# EasyEDA Pro project STM32平衡小车V1.0.eprj

# Schematic 平衡小车

## Sheets
1 STM32F103C8T6: Create Date: 2023-11-09; Page Name: STM32F103C8T6; Project Name: STM32平衡小车V1.1; Schematic Name: 平衡小车V1.0; Update Date: 2023-12-01; Company: 嘉立创EDA; Page Size: A4; Version: V1.0
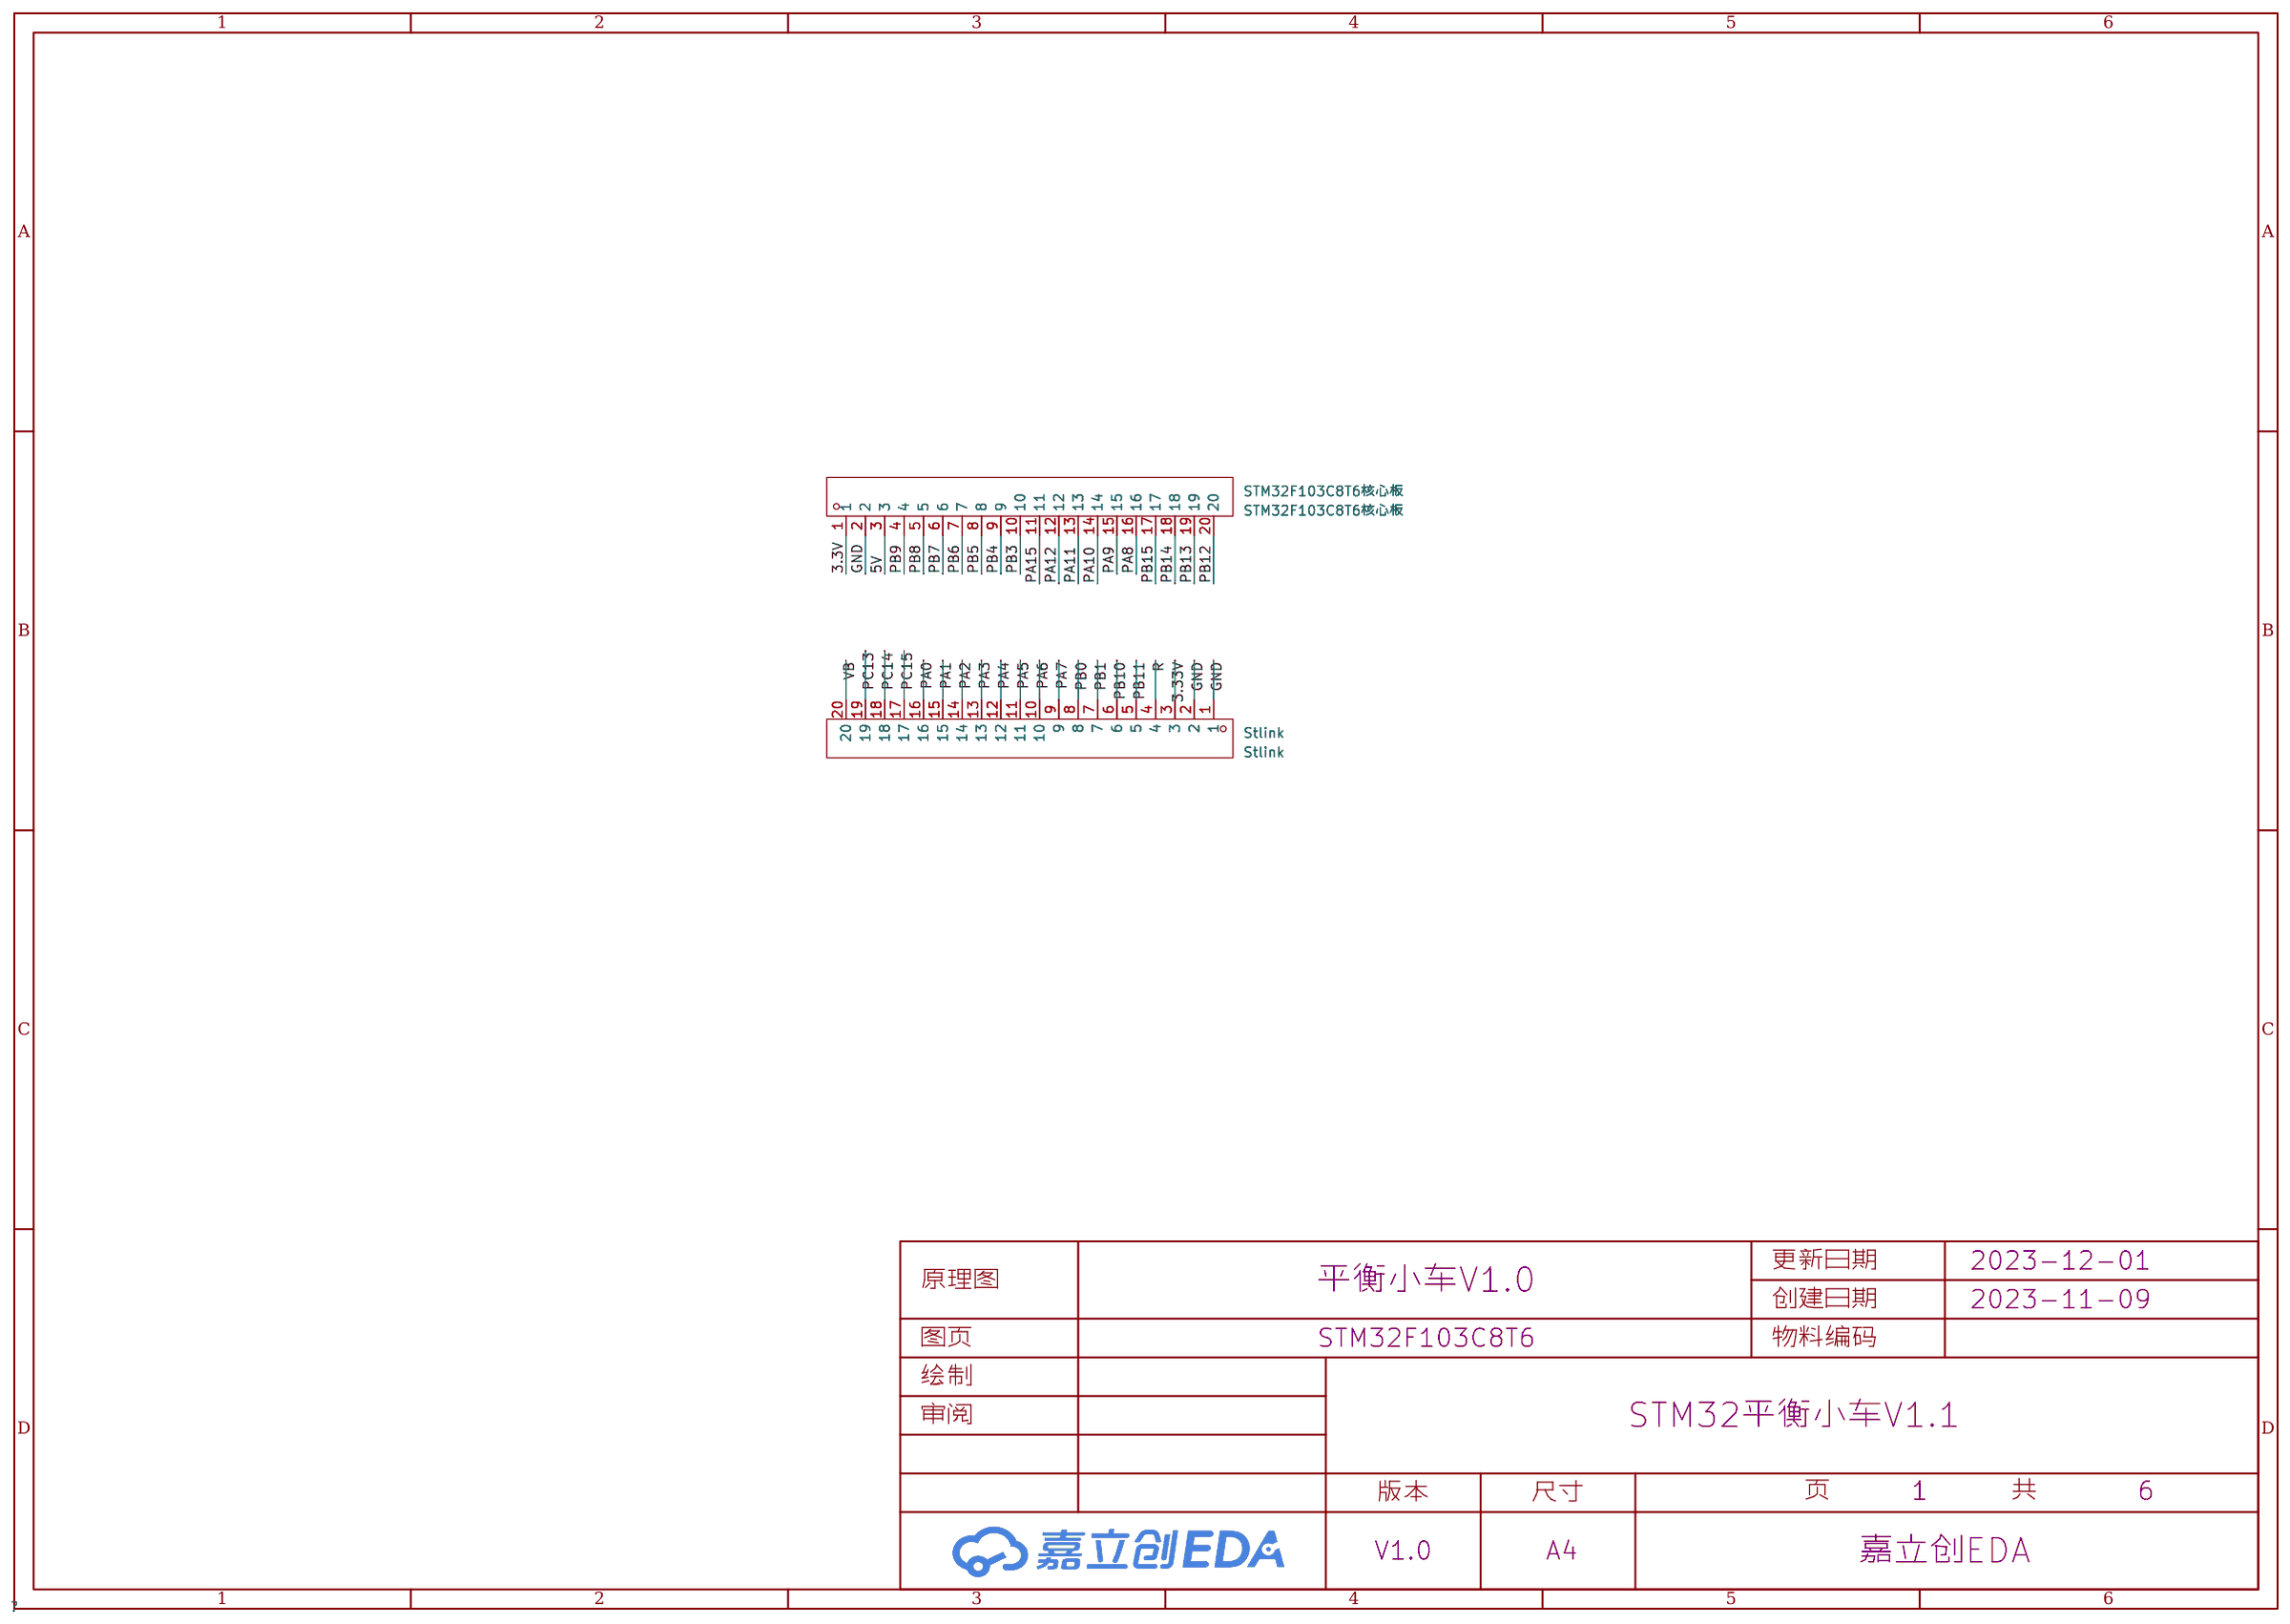
[diagram p0: STM32F103C8T6]
2 串口: Page Name: 串口
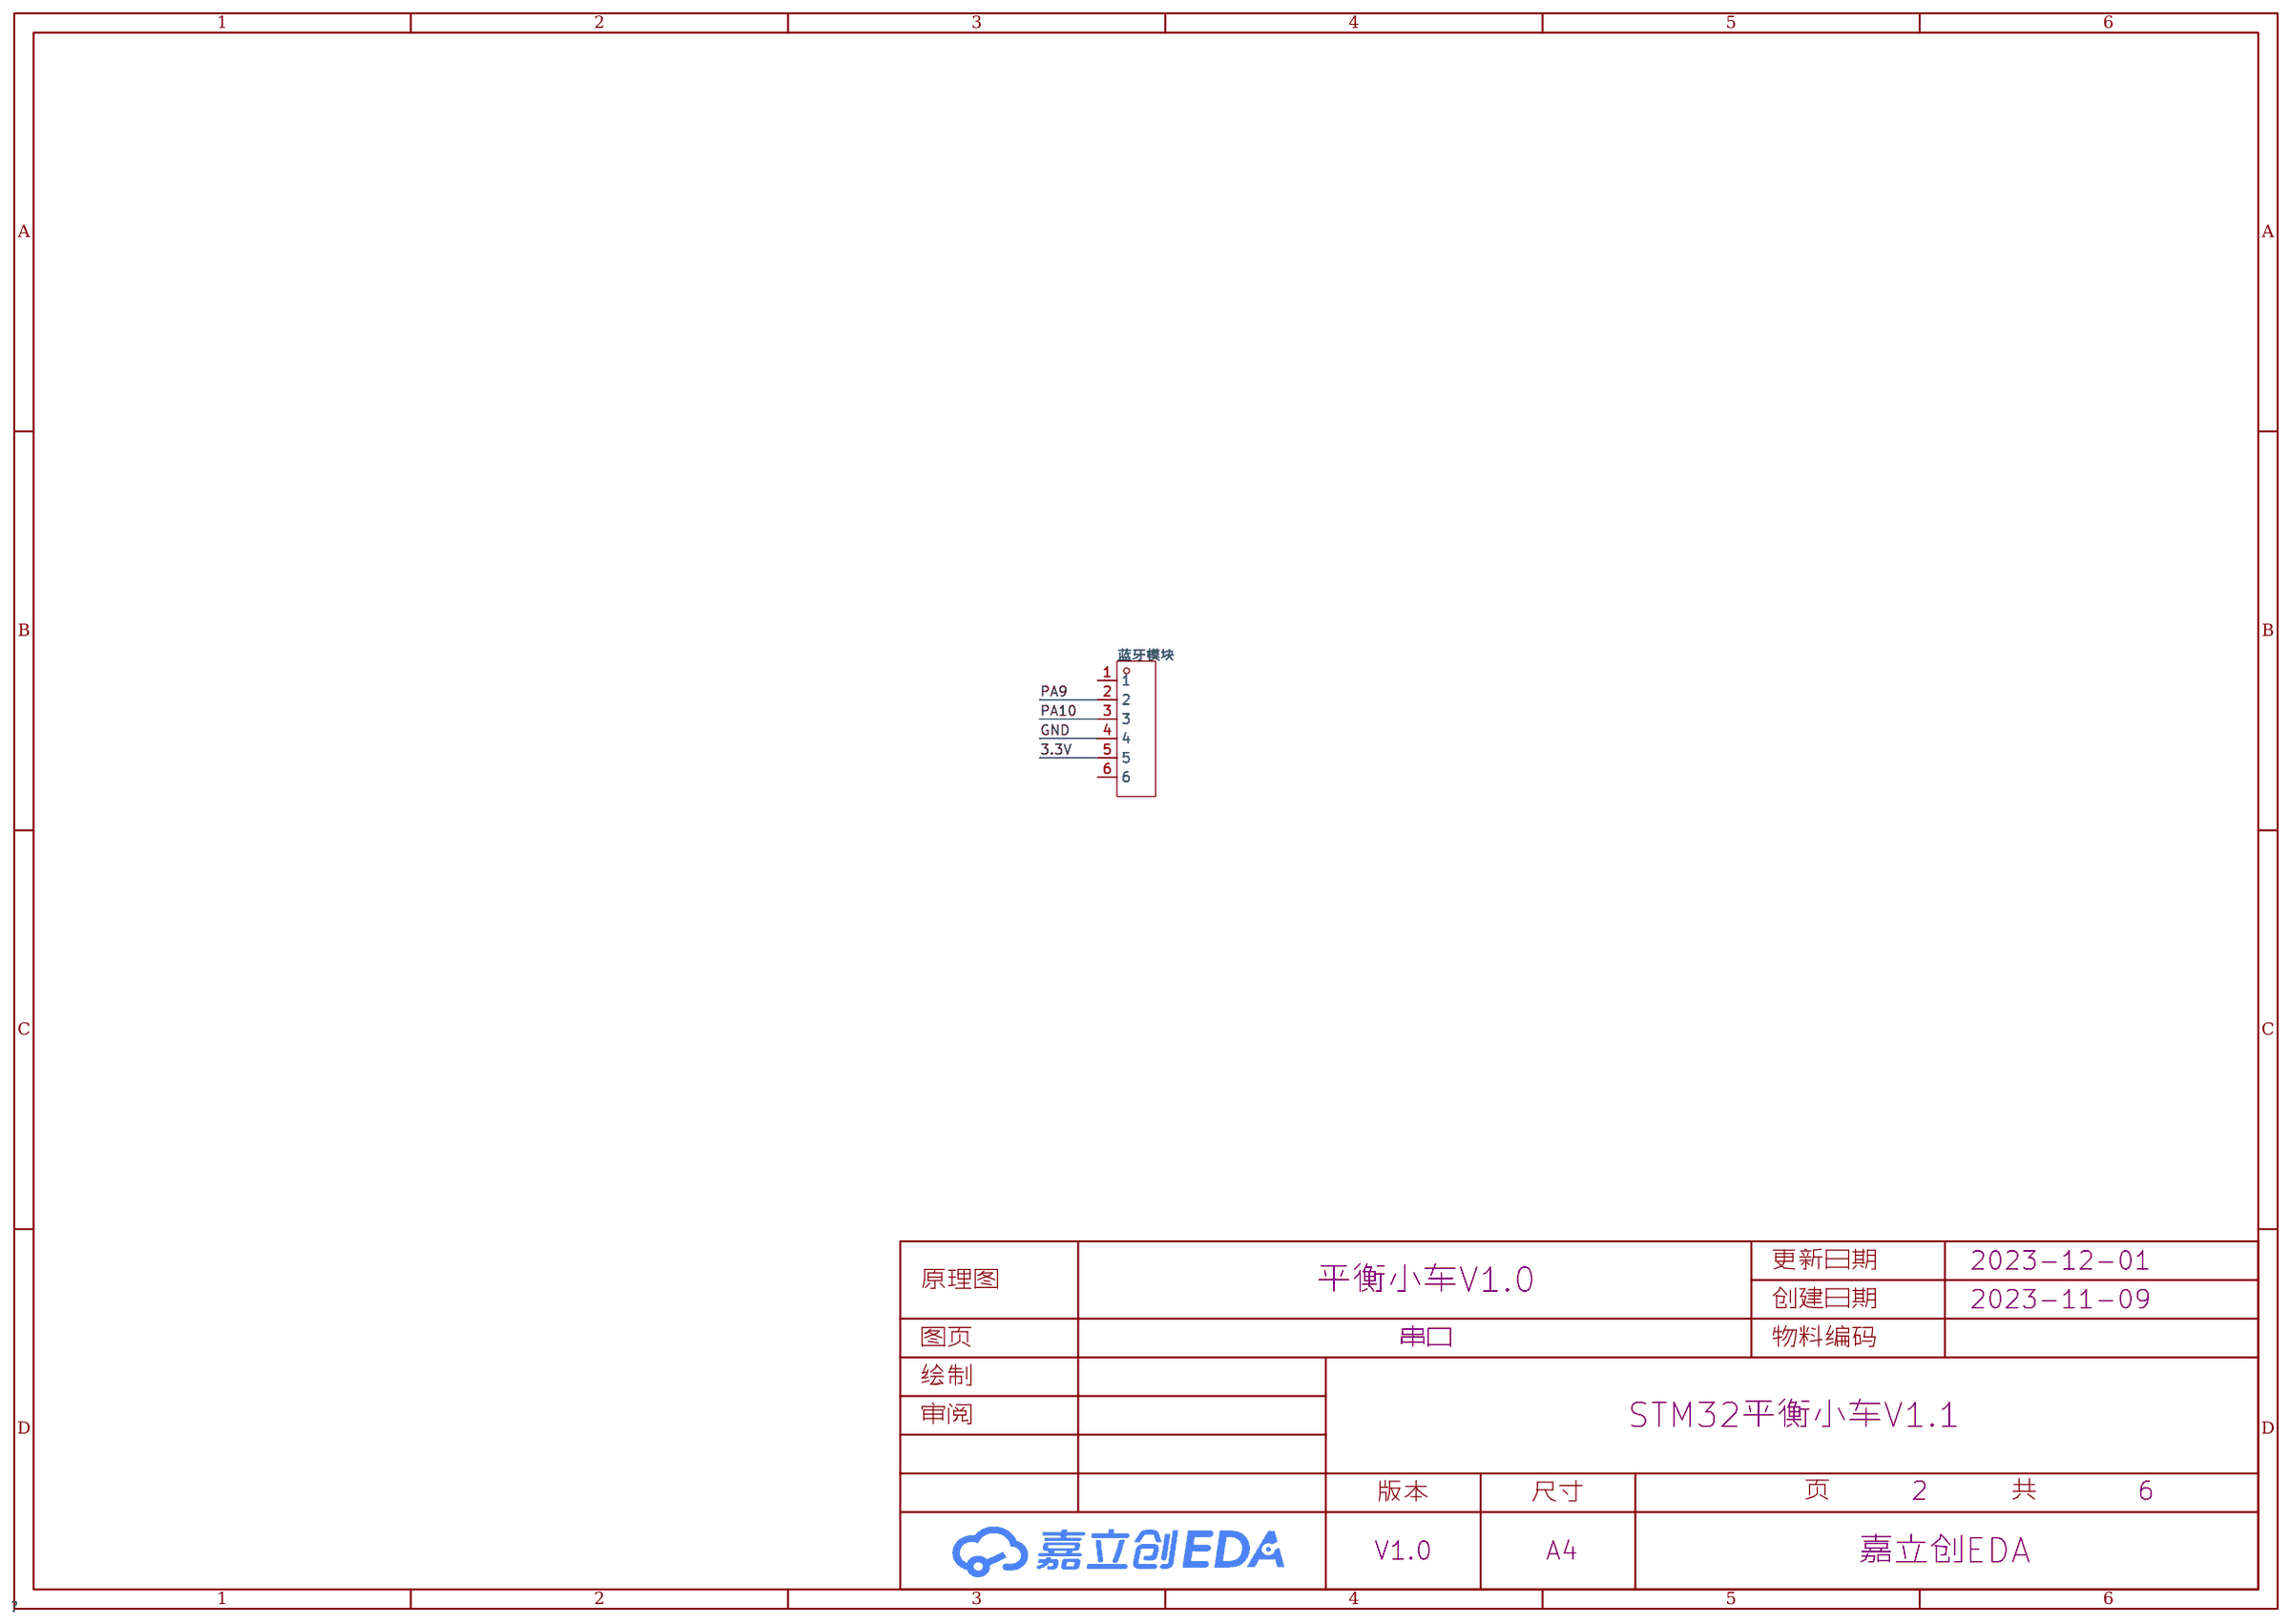
[diagram p1: 串口]
3 陀螺仪: Page Name: 陀螺仪; Update Date: 2023-11-09
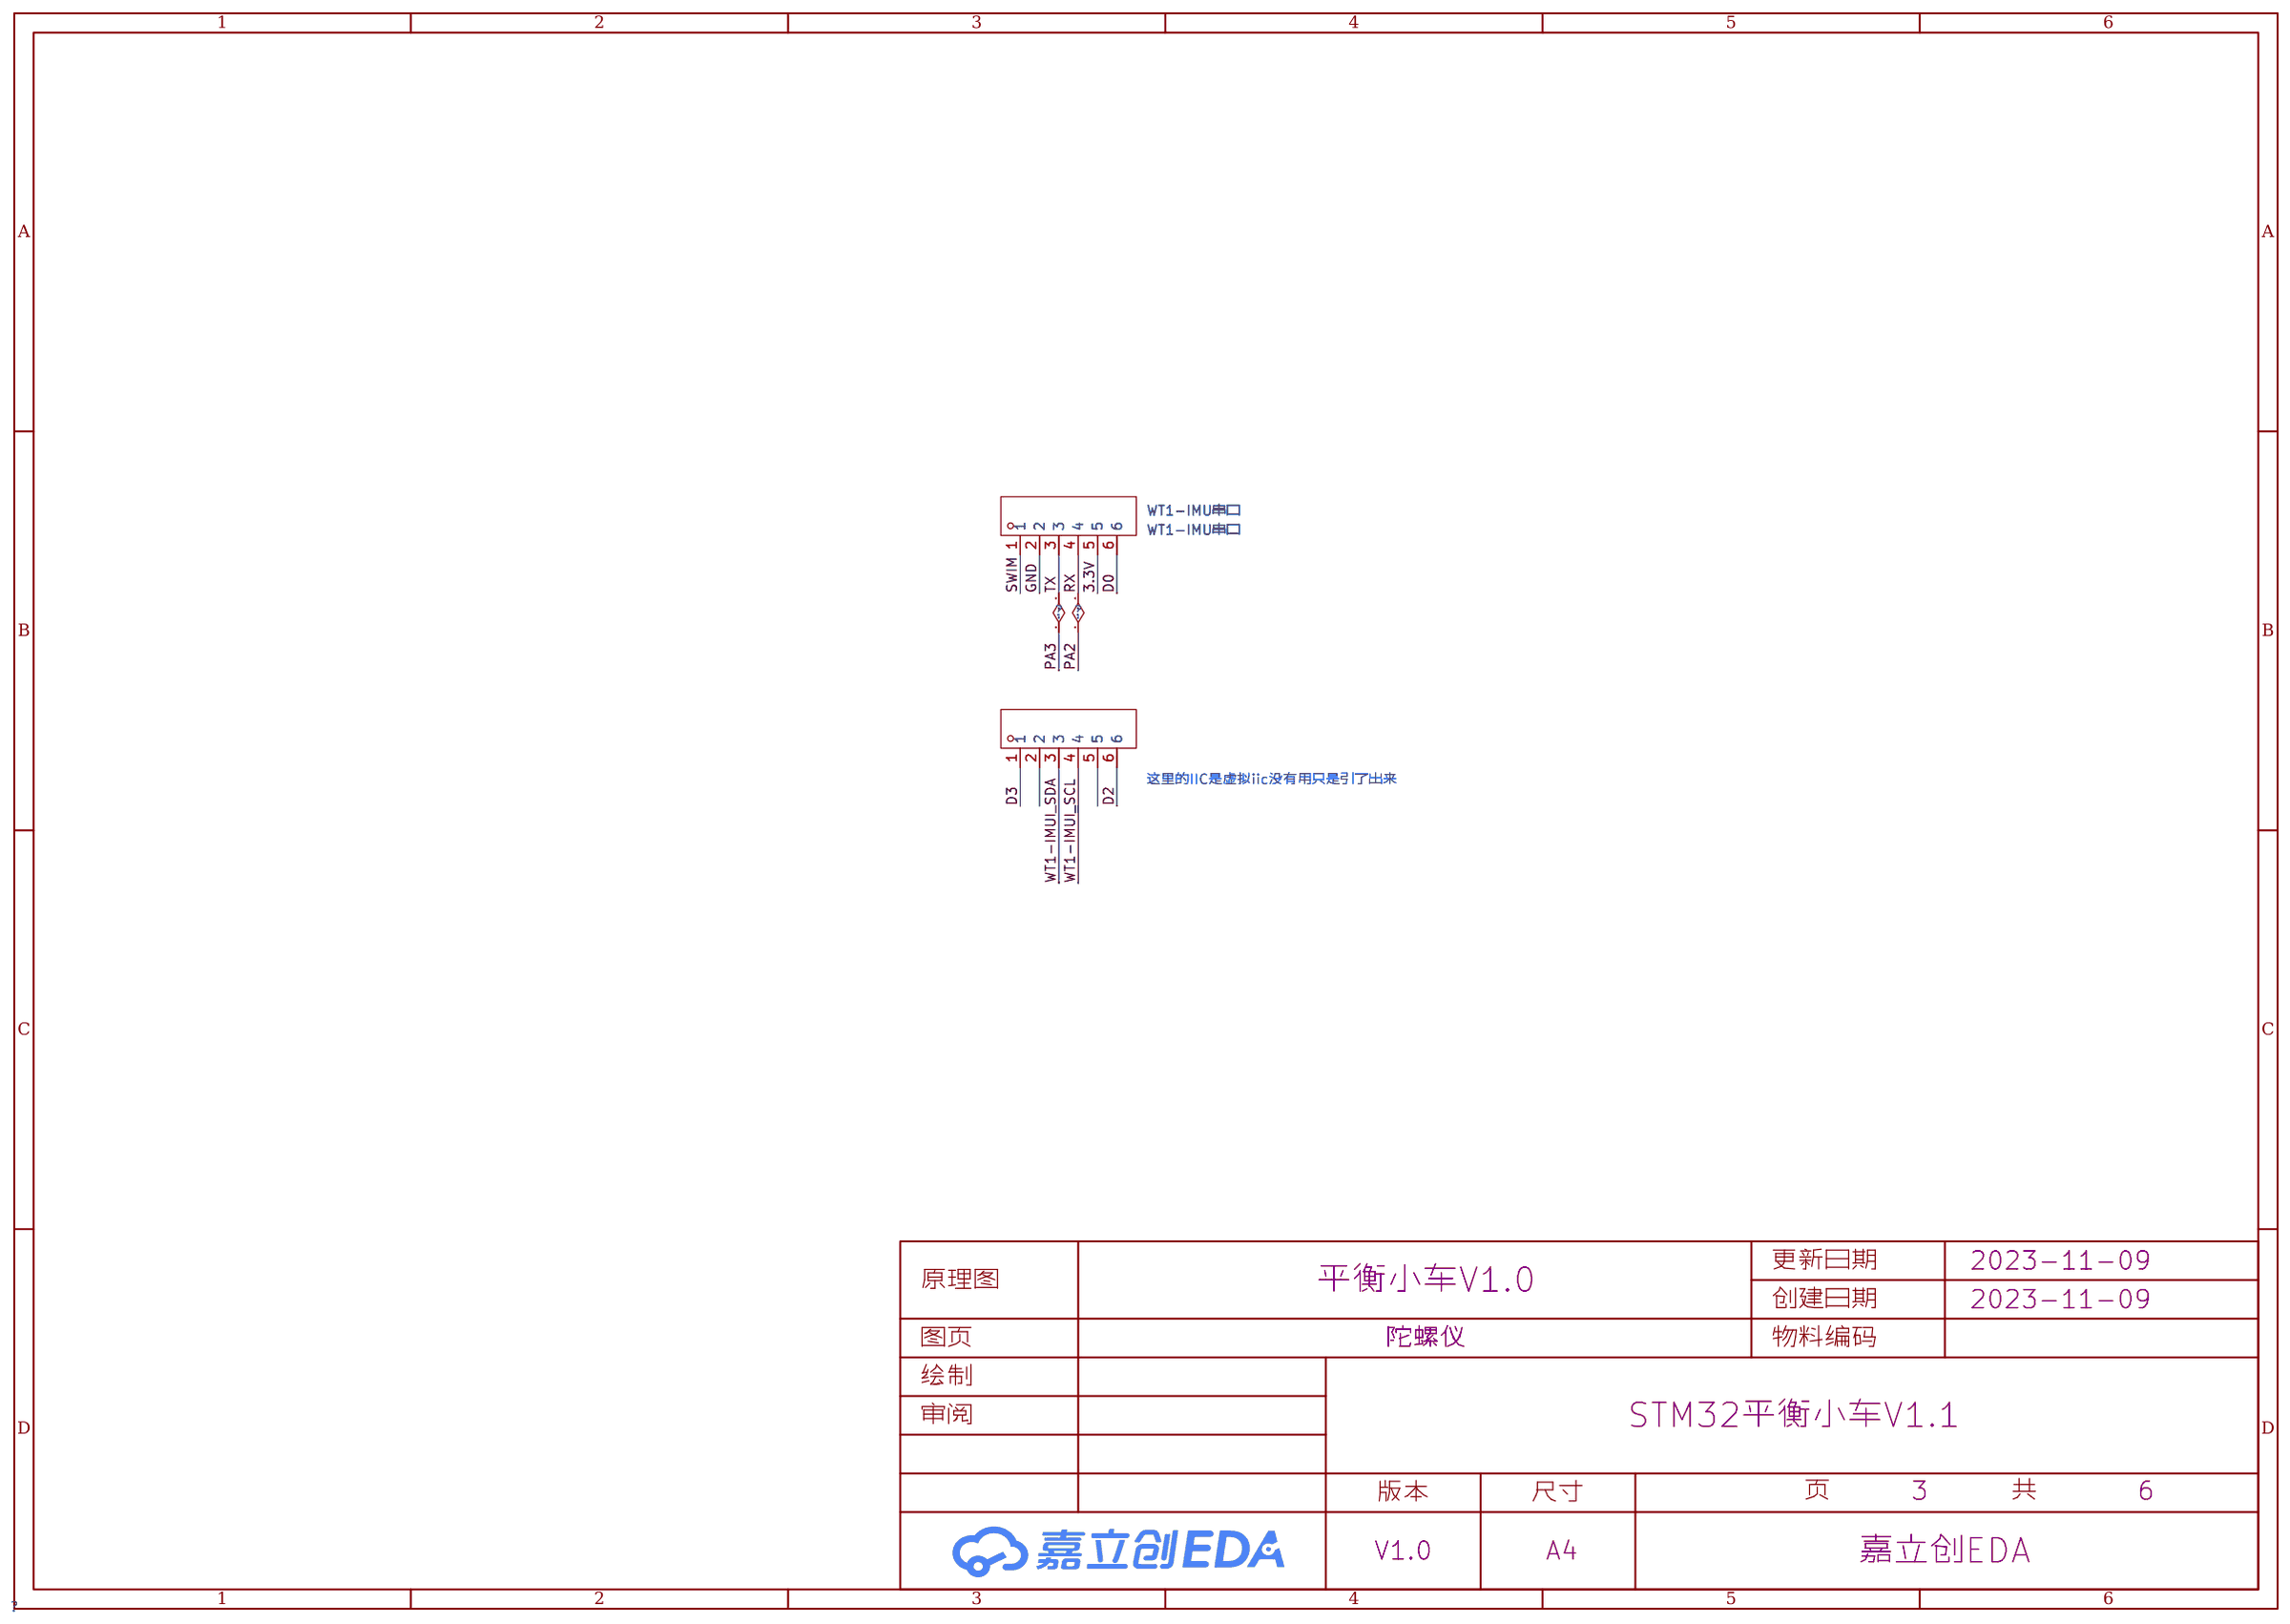
[diagram p2: 陀螺仪]
4 电源与降压模块: Page Name: 电源与降压模块; Update Date: 2023-11-22
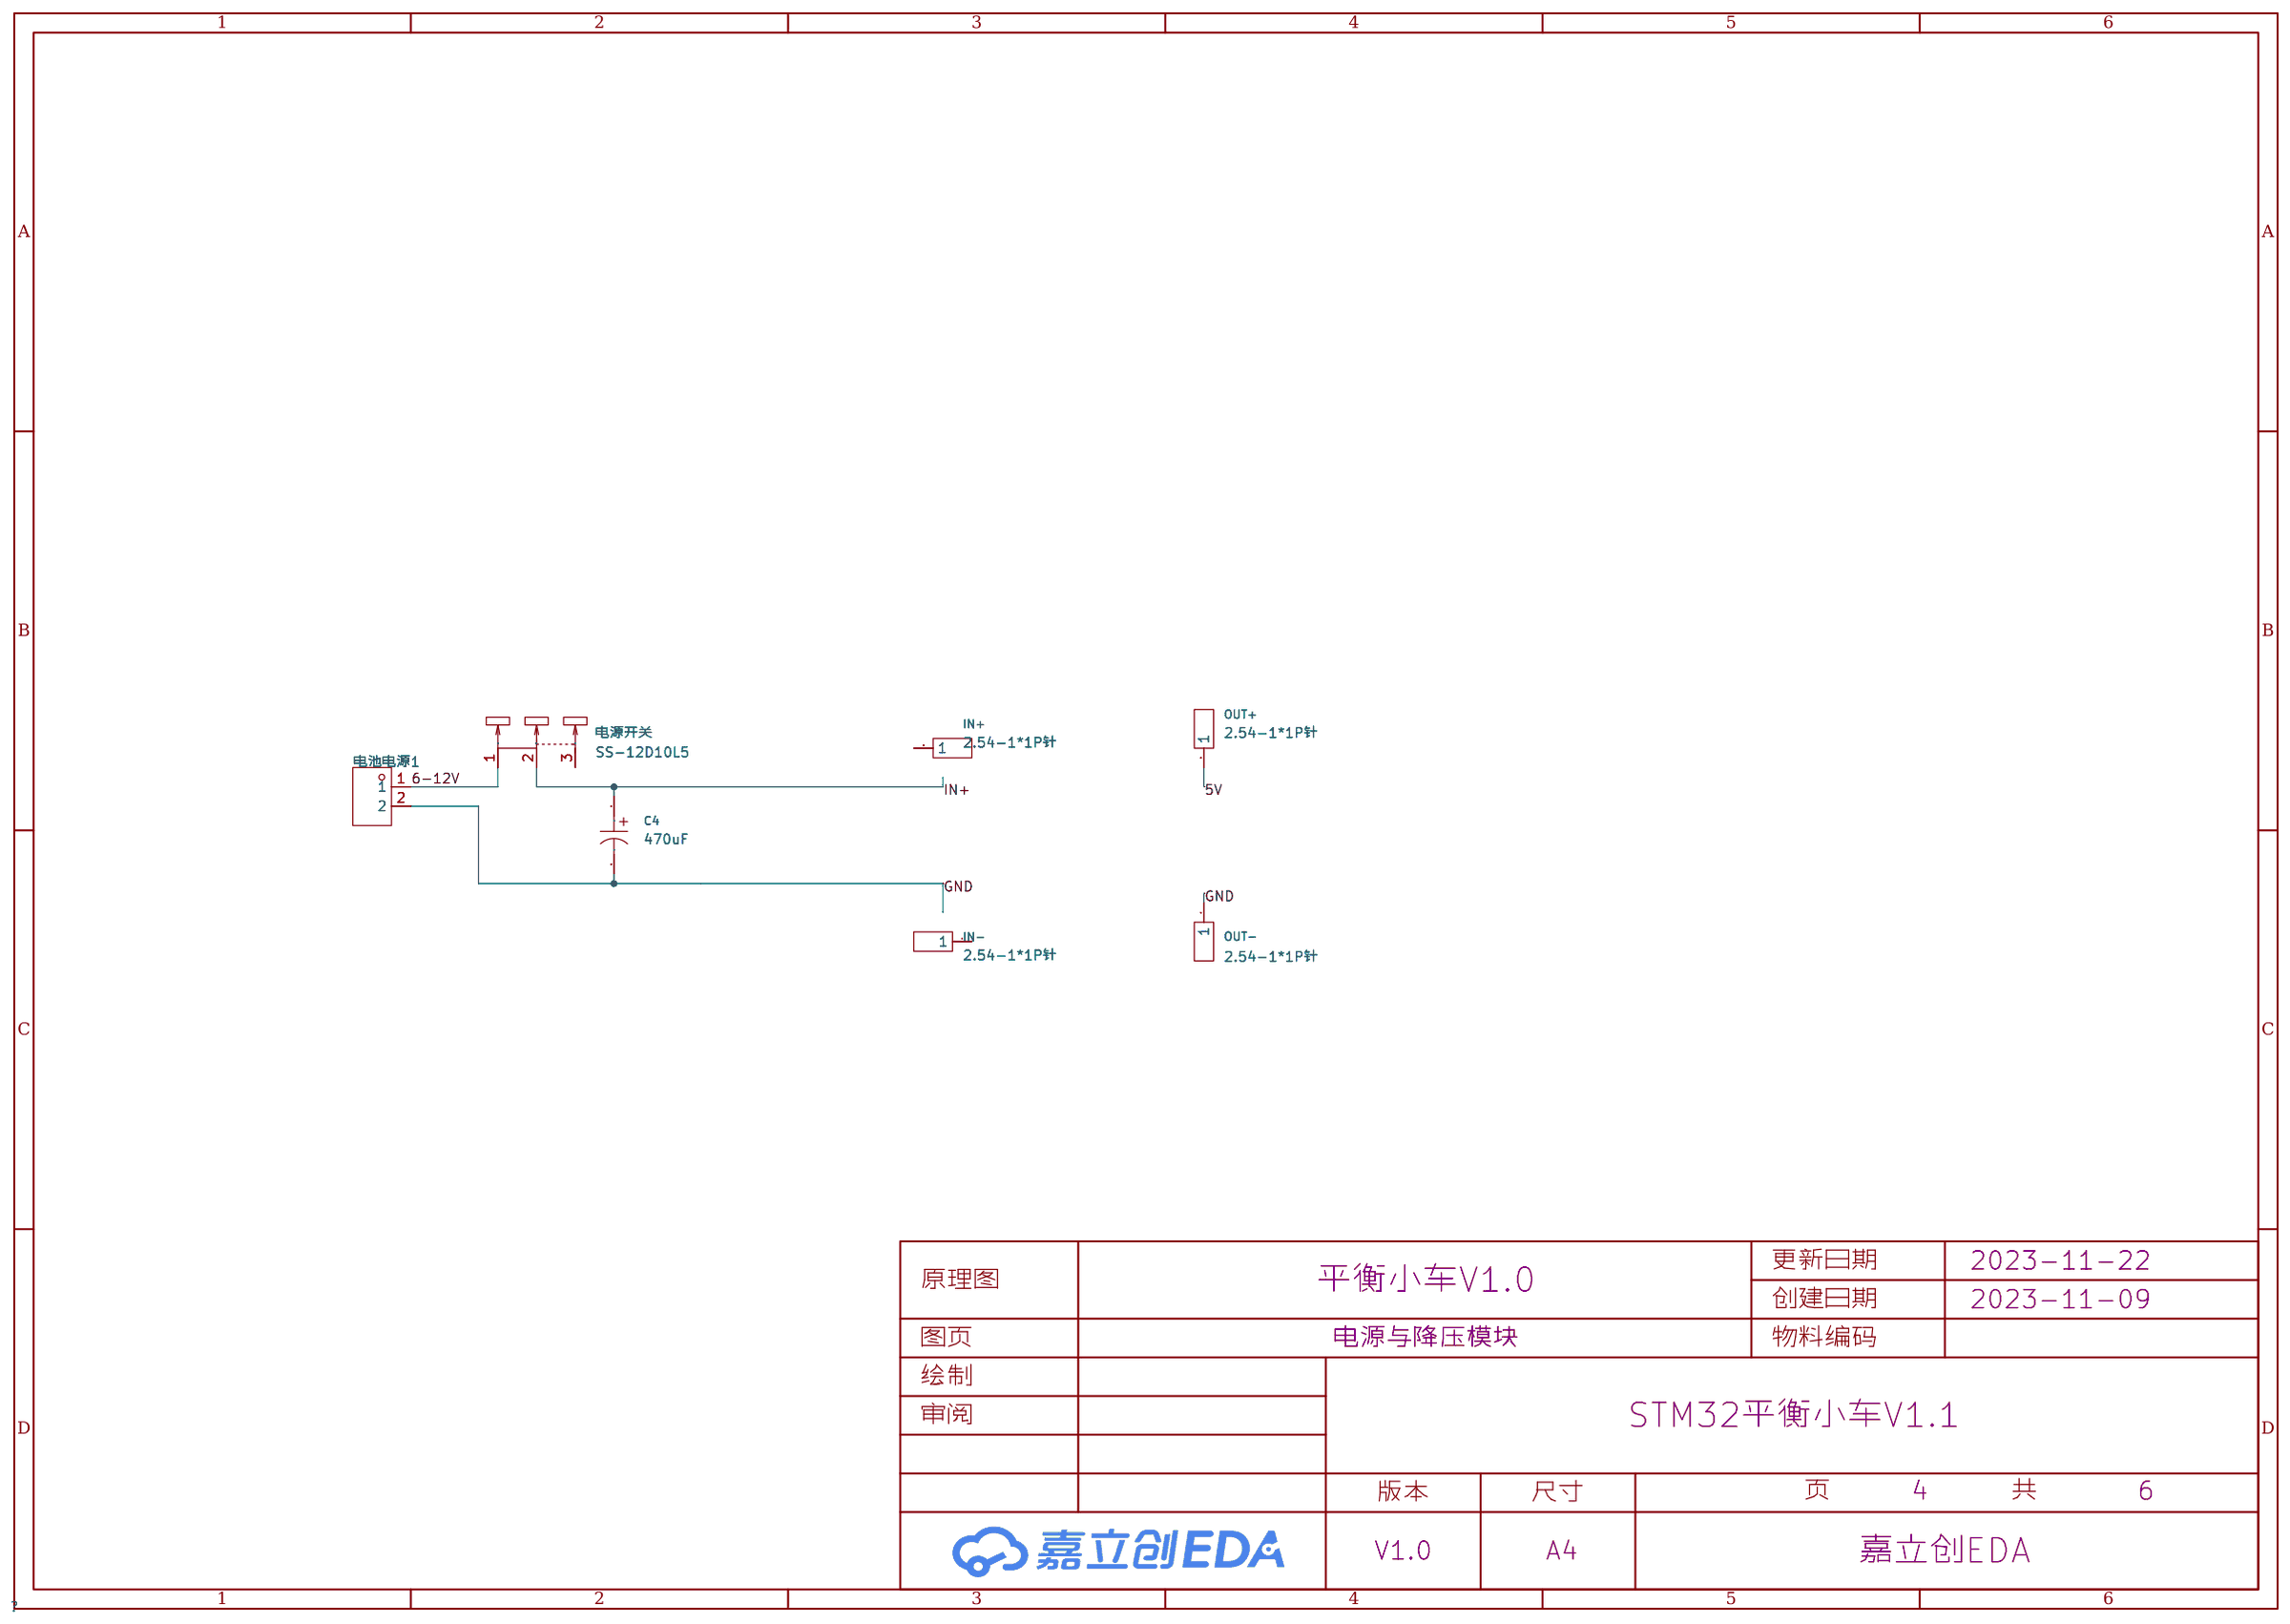
[diagram p3: 电源与降压模块]
5 电机驱动模块与电机接口: Page Name: 电机驱动模块与电机接口; Update Date: 2023-11-22
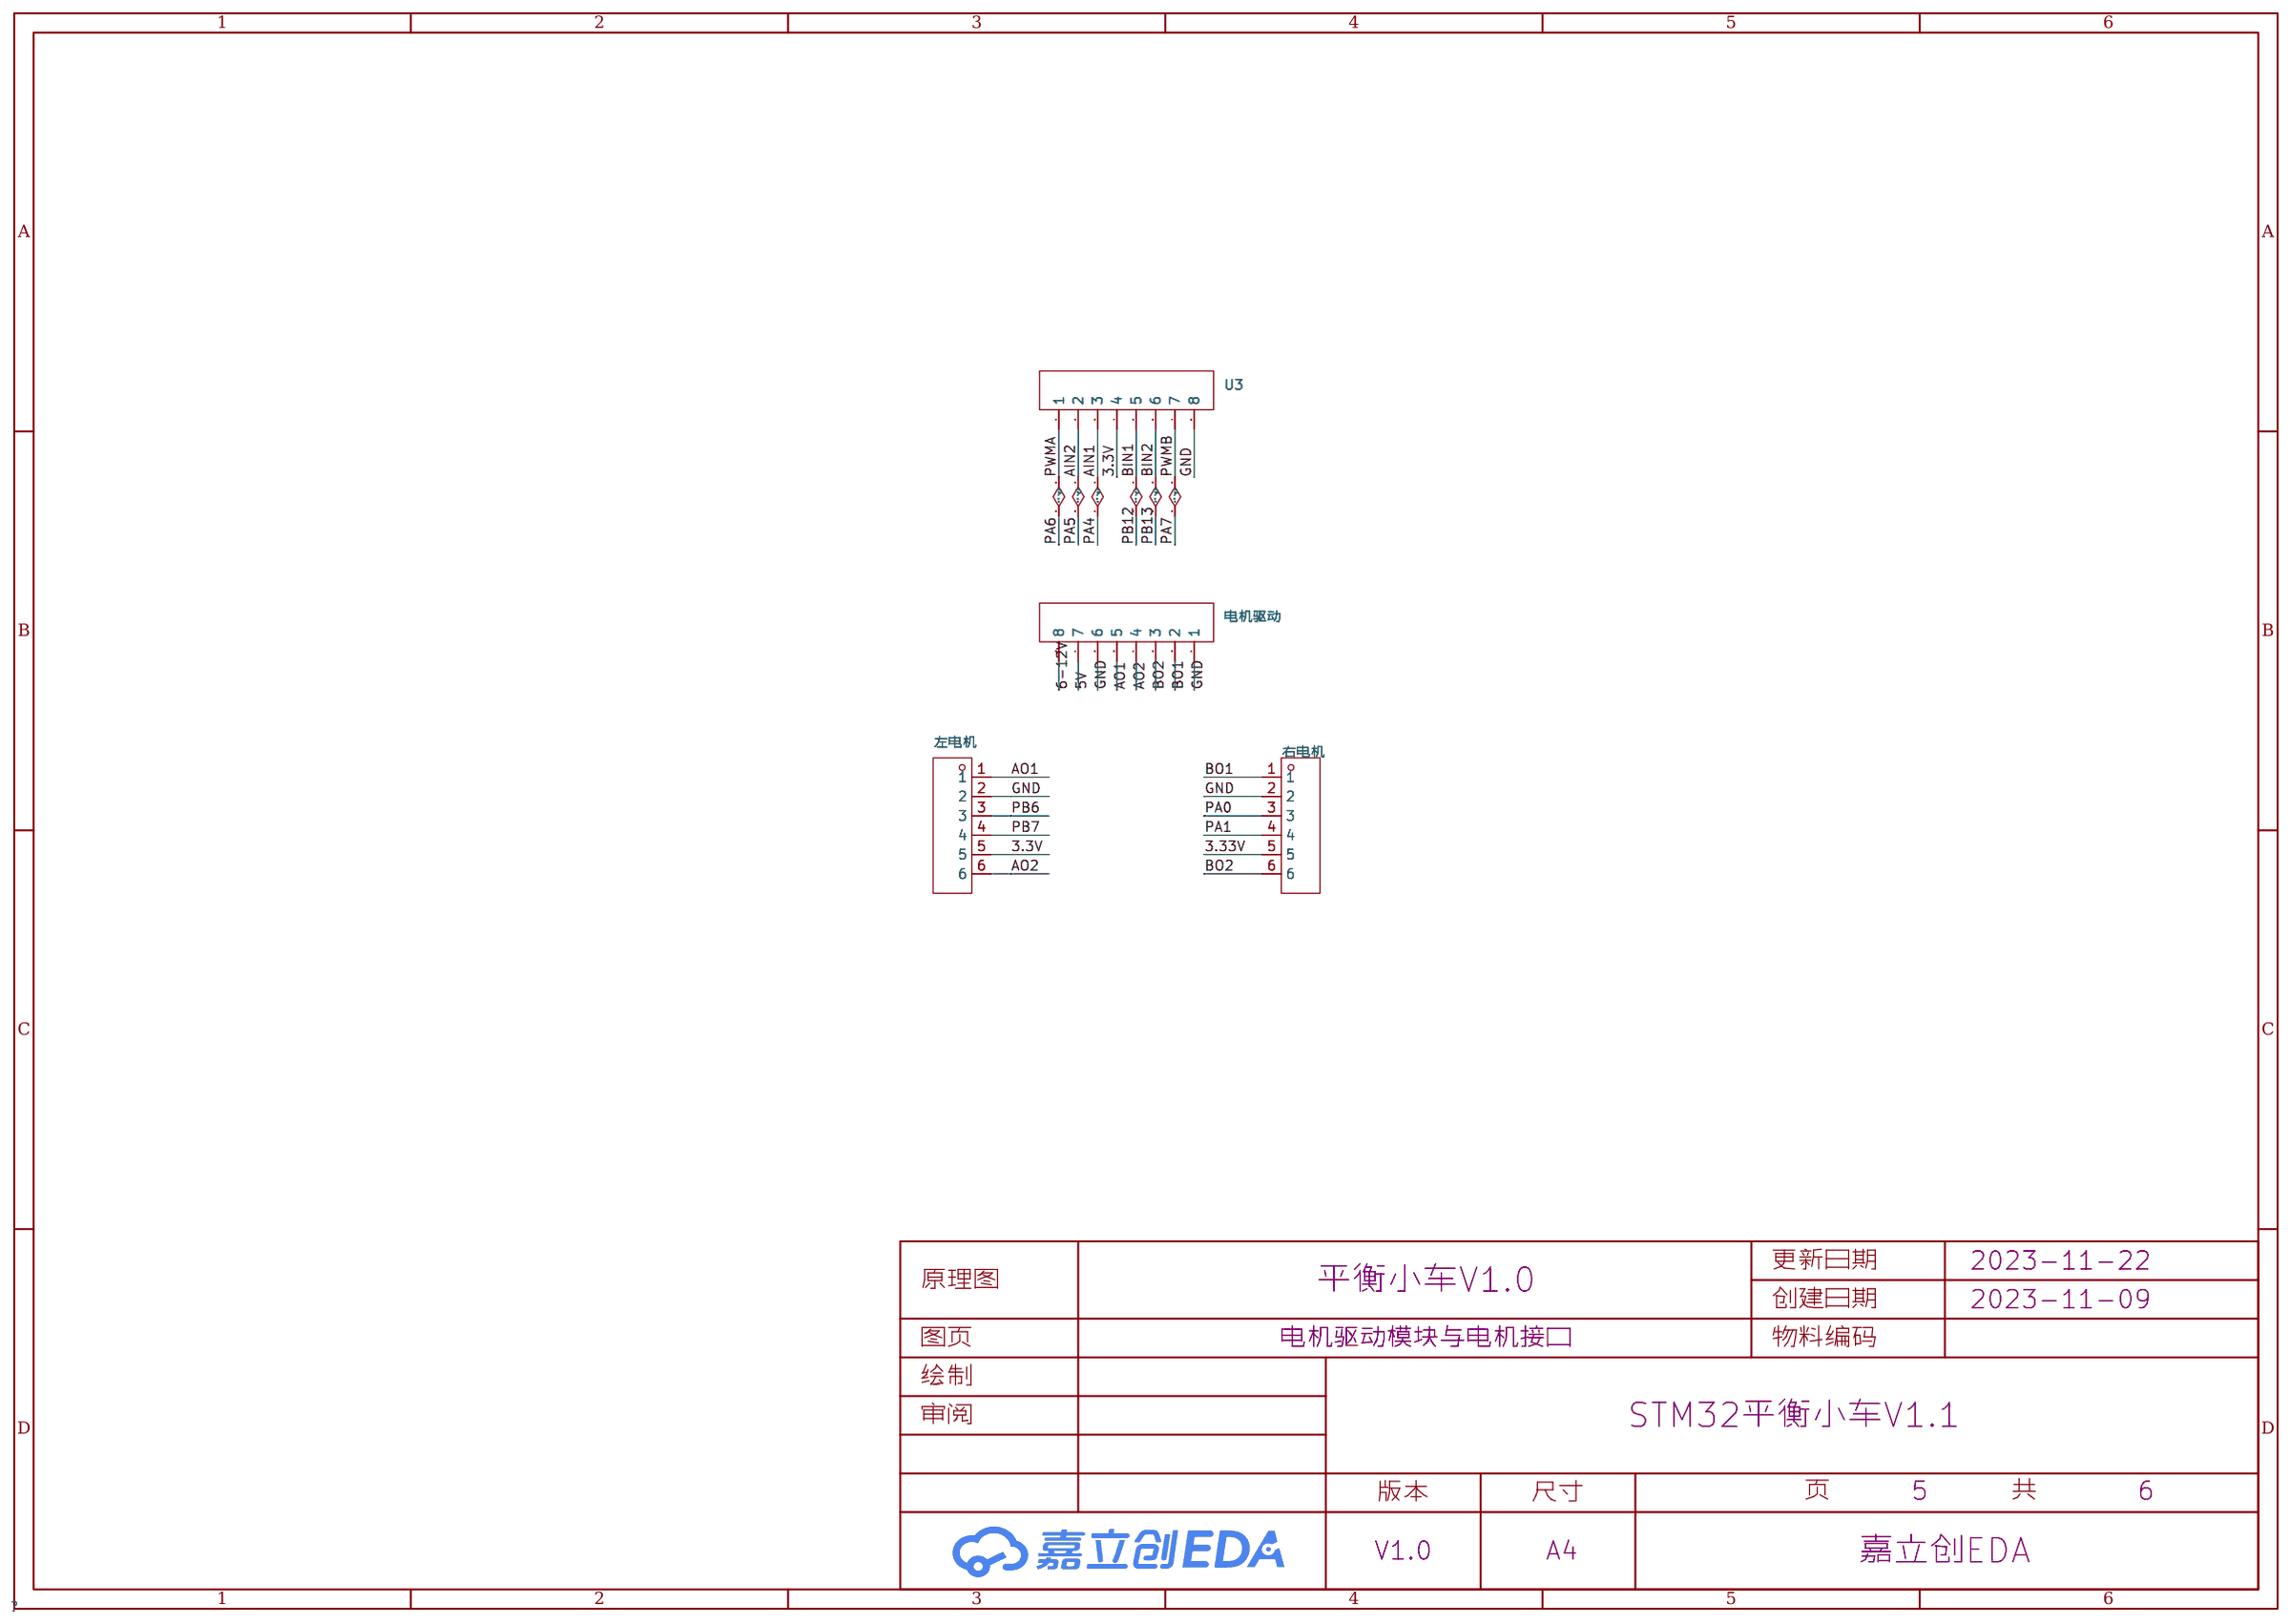
[diagram p4: 电机驱动模块与电机接口]
6 OLED: Page Name: OLED; Project Name: STM32平衡小车V1.0; Update Date: 2023-11-09
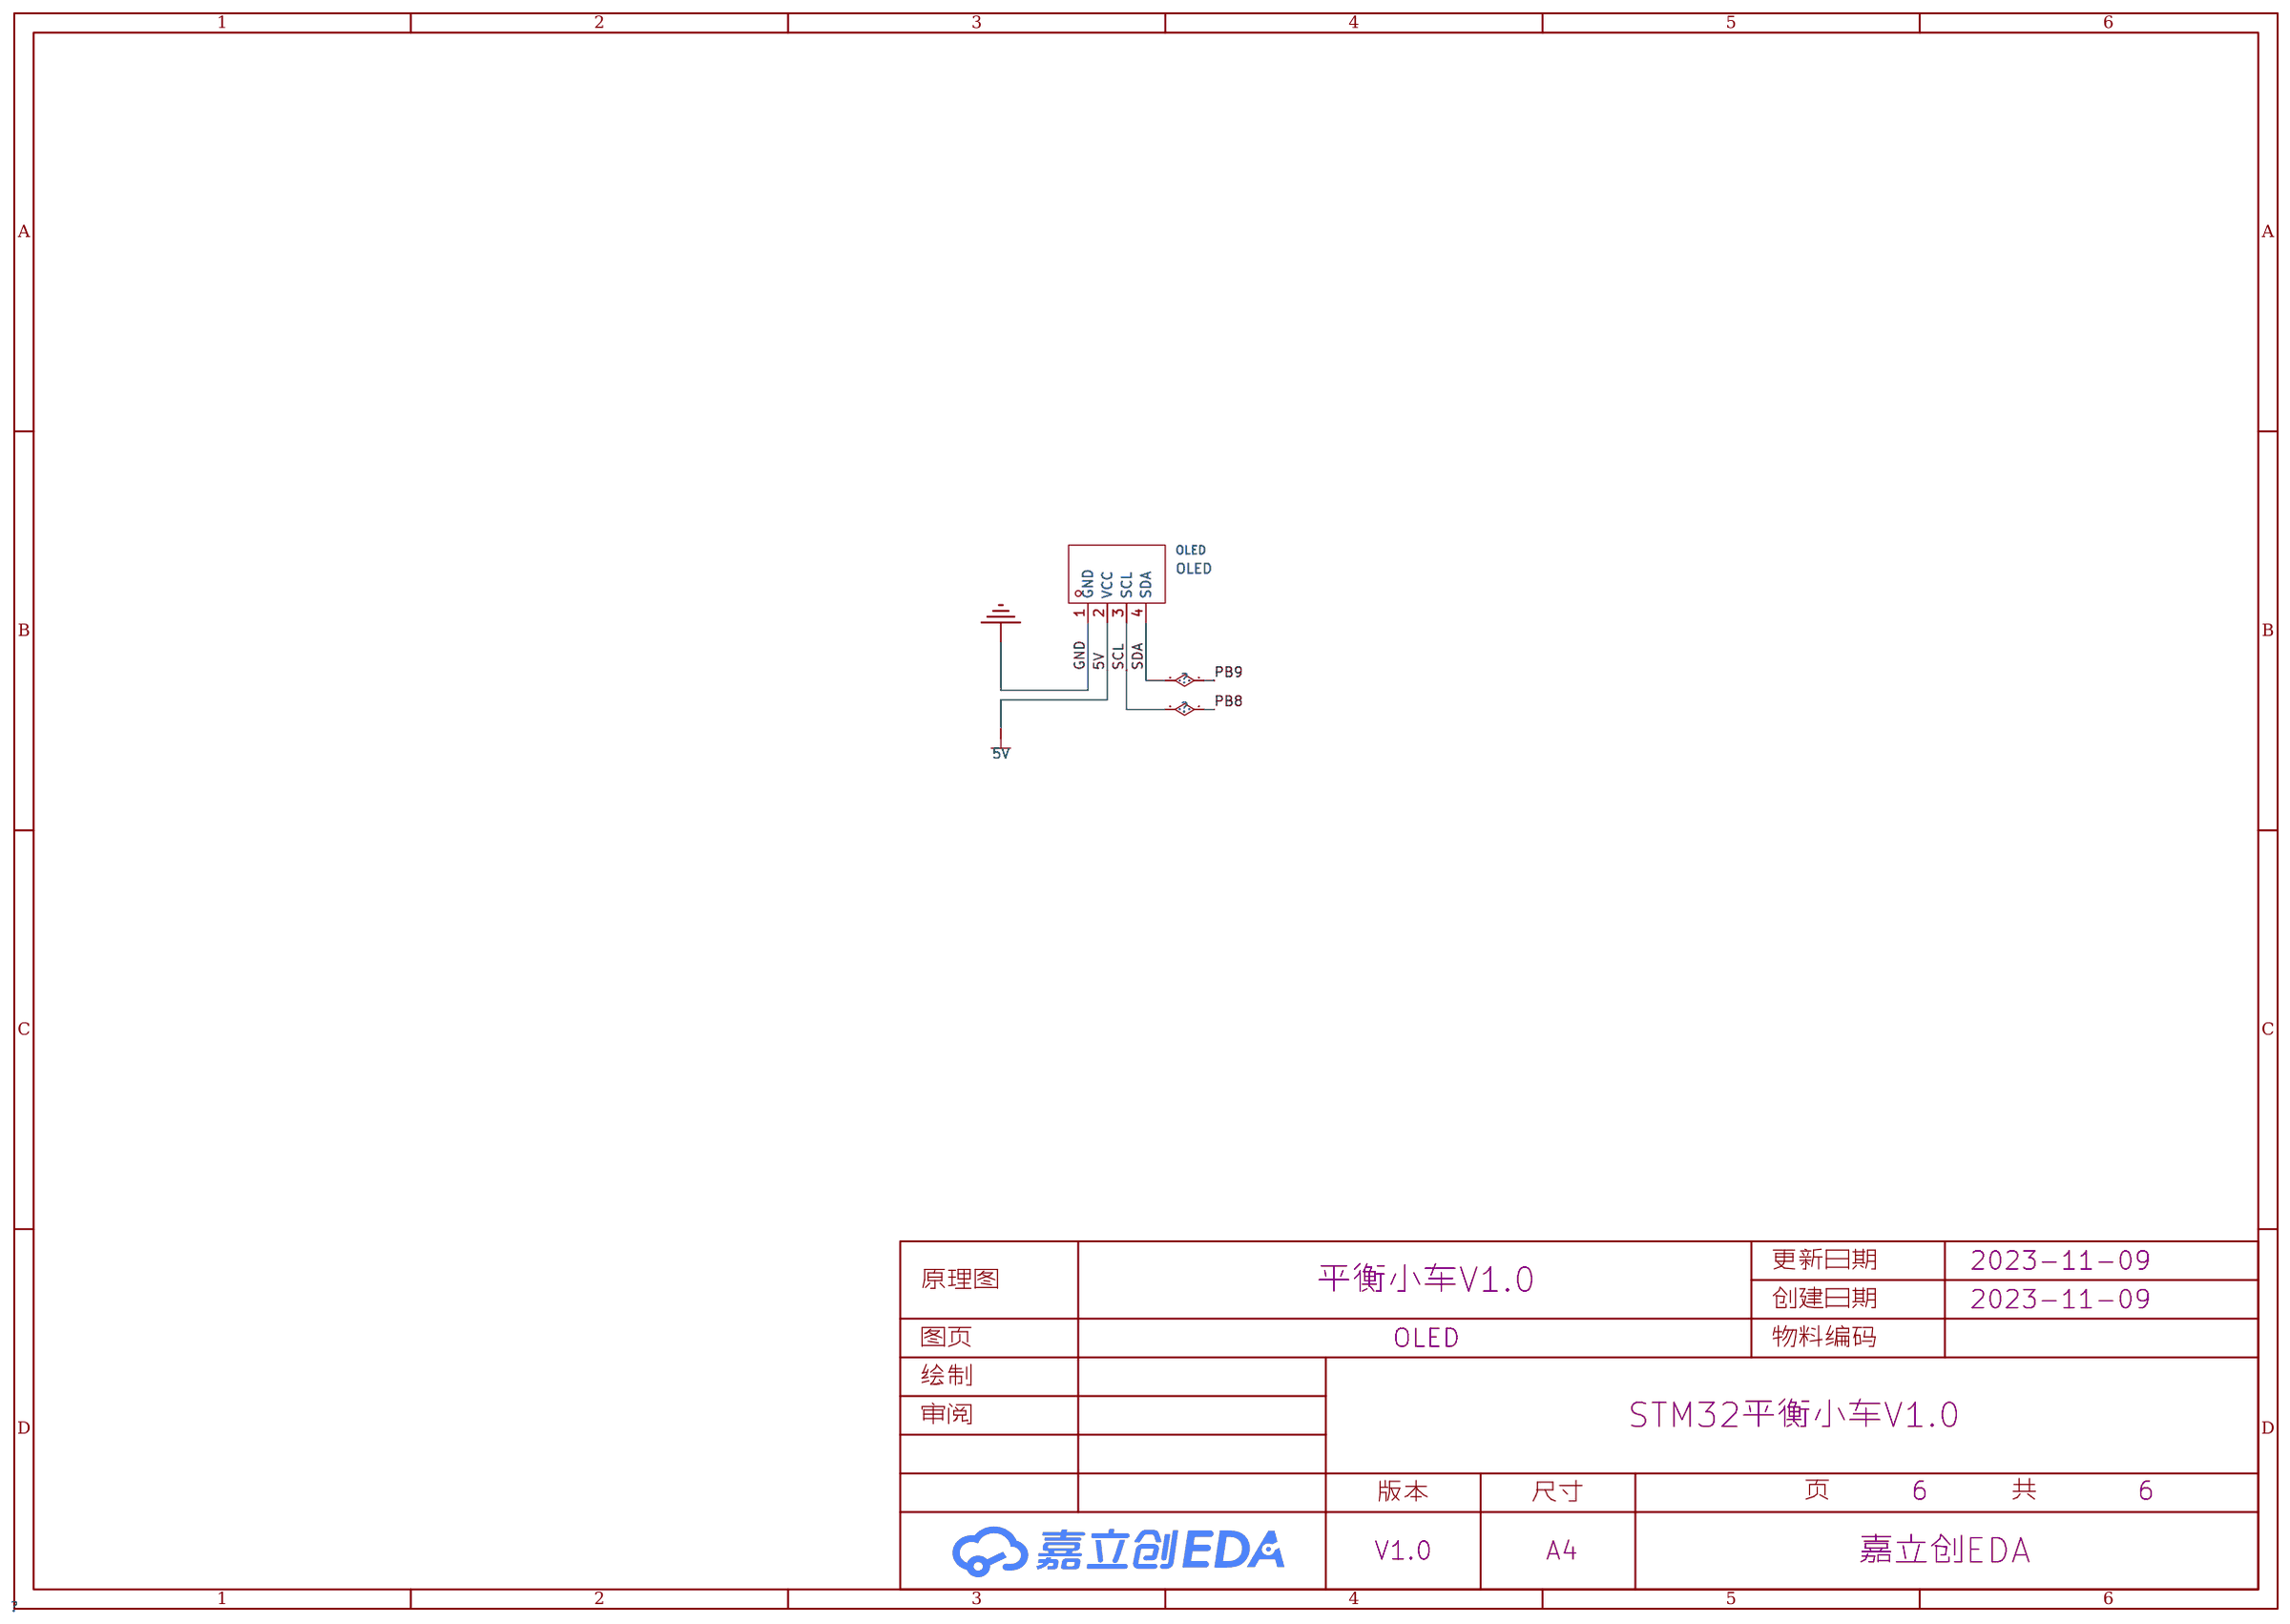
[diagram p5: OLED]

## Parts
sheet OLED
OLED  OLED  [OLED-TH_L27.8-W27.2-P2.54_C9900033791]
sheet STM32F103C8T6
Stlink  Stlink  [HDR-TH_20P-P2.54-V-F]
STM32F103C8T6核心板  STM32F103C8T6核心板  [HDR-TH_20P-P2.54-V-F]
sheet 串口
蓝牙模块  2.54-1*6P母  [HDR-TH_6P-P2.54-V-F]
sheet 电机驱动模块与电机接口
U3  2.54-1*8P母环保  [HDR-TH_8P-P2.54-V-F-1]
右电机  HDGC2001WR-6P  [CONN-TH_6P-P2.00_HDGC_HDGC2001WR-6P]
左电机  HDGC2001WR-6P  [CONN-TH_6P-P2.00_HDGC_HDGC2001WR-6P]
电机驱动  2.54-1*8P母环保  [HDR-TH_8P-P2.54-V-F-1]
sheet 电源与降压模块
C4  470uF  [CAP-SMD_BD6.3-L6.6-W6.6-LS7.6-RD]
IN+  2.54-1*1P针  [HDR-TH_1P-P2.54-V-M]
IN-  2.54-1*1P针  [HDR-TH_1P-P2.54-V-M]
OUT+  2.54-1*1P针  [HDR-TH_1P-P2.54-V-M]
OUT-  2.54-1*1P针  [HDR-TH_1P-P2.54-V-M]
电池电源1  ZX-XH2.54-2PZZ  [CONN-TH_2P-P2.50_HX25003-2A]
电源开关  SS-12D10L5  [SW-TH_SS-12D10L5]
sheet 陀螺仪
U1  2.54-1*6P母  [HDR-TH_6P-P2.54-V-F]
WT1-IMU串口  WT1-IMU串口  [HDR-TH_6P-P2.54-V-F]

## Library data of the parts
OLED = HS96L03W2C03: 尺寸(inch)：0.96寸 0.96&apos; 像素分辨率：128x64 128*64主控芯片：SSD1315 接口类型：I2C 外形:27.3*27.8；IIC/3SPI/4SPI串口通讯,工作温度范围-40℃—+70℃。4PIN黑底白光。; LCSC Part Name: 0.96寸OLED显示屏窄白光IIC; Supplier Part: C5248080; Manufacturer: HS(汉昇); JLCPCB Part Class: Extended Part; Datasheet: https://atta.szlcsc.com/upload/public/pdf/source/20230627/763D01F79A90007632F098068C7C8AD9.pdf; Supplier: LCSC
Stlink STM32F103C8T6核心板 = 22850120ANG1SYA01: 排数:单排;总孔位数:20P;间距:2.54mm;插孔结构:1x20P;行距:-;安装类型:直插;塑高:-;触头材质:黄铜;触头镀层:-;; LCSC Part Name: 间距:2.54mm 1x20P 直插; Supplier Part: C429947; Manufacturer: JILN(锦凌); Supplier Footprint: 插件,P=2.54mm; JLCPCB Part Class: 扩展库; Datasheet: https://atta.szlcsc.com/upload/public/pdf/source/20190920/C429966_F6288D72CB1EF194DAF75E8AC5D57877.pdf; Supplier: LCSC; Number of Rows: 单排; Number of Holes: 20P; Pitch: 2.54mm; Holes Structure: 1x20P; Mounting Type: 直插; Contact Material: 黄铜
U1 WT1-IMU串口 蓝牙模块 = 2.54-1*6P母: 排数:单排;总孔位数:6P;间距:2.54mm;插孔结构:1x6P;行距:-;安装类型:直插;塑高:-;触头材质:-;触头镀层:-;; LCSC Part Name: 间距:2.54mm 1x6P 直插; Supplier Part: C40877; Manufacturer: BOOMELE(博穆精密); Supplier Footprint: 插件,P=2.54mm; JLCPCB Part Class: 扩展库; Datasheet: https://atta.szlcsc.com/upload/public/pdf/source/20210301/C2718488_F4427B881E42CAA8DDB0B1C12B3A522C.pdf; Supplier: LCSC; Number of Rows: 单排; Number of Holes: 6P; Pitch: 2.54mm; Holes Structure: 1x6P; Mounting Type: 直插
U3 电机驱动 = 2.54-1*8P母环保: 排数:单排;总孔位数:8P;间距:2.54mm;插孔结构:1x8P;行距:-;安装类型:直插;塑高:-;触头材质:-;触头镀层:-;; LCSC Part Name: 间距:2.54mm 1x8P 直插; Supplier Part: C27438; Manufacturer: BOOMELE(博穆精密); Supplier Footprint: 插件,P=2.54mm; JLCPCB Part Class: Extended Part; Datasheet: https://atta.szlcsc.com/upload/public/pdf/source/20210301/C2718488_F4427B881E42CAA8DDB0B1C12B3A522C.pdf; Supplier: LCSC; Number of Rows: 单排; Number of Holes: 8P; Pitch: 2.54mm; Holes Structure: 1x8P; Mounting Type: 直插
右电机 左电机 = HDGC2001WR-6P: LCSC Part Name: PH2.0弯针 6P; Supplier Part: C5175243; Manufacturer: HDGC(华德共创); Supplier Footprint: 弯插,P=2mm; JLCPCB Part Class: 扩展库; Datasheet: https://atta.szlcsc.com/upload/public/pdf/source/20220916/36534CA64A2134C65DEF28B604EC5CCB.pdf; Supplier: LCSC
C4 = RVT1C471M0607: 容值:470uF;精度:±20%;额定电压:16V;电容体直径:6.3mm;电容体长度:7.7mm;工作寿命:2000hrs@105℃;工作温度:-55℃~+105℃;; LCSC Part Name: 470uF ±20% 16V; Supplier Part: C2977552; Manufacturer: ROQANG(容强); Supplier Footprint: SMD,6.3x7.7mm; JLCPCB Part Class: 扩展库; Supplier: LCSC; Tolerance: ±20%; Rated Voltage: 16V; φD: 6.3mm; L: 7.7mm; Lifetime @ Temp: 2000hrs@105℃; Operating Temperature: -55℃~+105℃
IN+ IN- OUT+ OUT- = 2.54-1*1P针: 排数:单排;总PIN位数:1P;间距:-;插针结构:-;行距:-;安装类型:直插;圆针/方针:-;额定电流:-;额定电压:-;配合针长度:-;塑高:-;触头材质:-;触头镀层:-;颜色:黑色;; LCSC Part Name: 直插; Supplier Part: C81276; Manufacturer: BOOMELE(博穆精密); Supplier Footprint: 插件,P=2.54mm; JLCPCB Part Class: 扩展库; Datasheet: https://atta.szlcsc.com/upload/public/pdf/source/20221018/3E9408392E35E6F57A28985E5F7BF5C9.pdf; Supplier: LCSC; Number of Rows: 单排; Number of Pins: 1P; Mounting Type: 直插; Color: 黑色
电池电源1 = ZX-XH2.54-2PZZ: 插针结构:1x2P;间距:2.54mm;公母:公;安装方式:直插;行距:-;排数:1;每排PIN数:2;参考系列:XH;额定电流:3A;触头材质:黄铜;触头镀层:锡;工作温度范围:-25℃~+85℃;焊接温度(最大值):260℃;; LCSC Part Name: 1x2P 间距:2.54mm 直插 系列:XH; Supplier Part: C7429632; Manufacturer: Megastar(兆星); Supplier Footprint: 插件,P=2.54mm; JLCPCB Part Class: 扩展库; Datasheet: https://atta.szlcsc.com/upload/public/pdf/source/20230619/19BA6947230AA44A04D3EDD65E618FD0.pdf; Supplier: LCSC; Pins Structure: 1x2P; Pitch: 2.54mm; Gender: 公; Mounting Style: 直插; Number of Rows: 1; Number of PINs Per Row: 2; Reference Series: XH; Current Rating (Max): 3A; Contact Material: 黄铜; Contact Plating: 锡; Operating Temperature Range: -25℃~+85℃; Welding Temperature (Max): 260℃
电源开关 = SS-12D10L5: 额定电流(DC):3A;额定电压(DC):125V;额定电流(AC):3A;额定电压(AC):125V;电路结构:单刀双掷;安装方式:直插;机械寿命:1万次;开关颜色:黑色;; LCSC Part Name: 柄长5mm 直插双档 滑动开关 大电流; Supplier Part: C319012; Manufacturer: XKB Connectivity(中国星坤); Supplier Footprint: 插件; JLCPCB Part Class: 扩展库; Datasheet: https://atta.szlcsc.com/upload/public/pdf/source/20211009/D6412F37AABE6F9459A6EE7FA4DAEADB.pdf; Supplier: LCSC; Current Rating (DC): 3A; Voltage Rating (DC): 125V; Current Rating (AC): 3A; Voltage Rating (AC): 125V; Circuit: 单刀双掷; Mounting Style: 直插; Mechanical Life: 1万次; Actuator Color: 黑色; Actuator Style: 矩形柱状; Pin Style: PC引脚; Operating Temperature: -40℃~+85℃; Switch Length: 13mm; Switch Width: 6.8mm; Switch Height: 6.4mm

## Nets
3.3V: STM32F103C8T6核心板.1 U3.4 WT1-IMU串口.5 左电机.5 蓝牙模块.5
3.33V: Stlink.3 右电机.5
5V: OLED.2(VCC) OUT+.1 STM32F103C8T6核心板.3 电机驱动.7
GND: C4.2 IN-.1 OLED.1(GND) OUT-.1 Stlink.1 Stlink.2 STM32F103C8T6核心板.2 U3.8 WT1-IMU串口.2 右电机.2 左电机.2 电机驱动.1 电机驱动.6 电池电源1.2 蓝牙模块.4
6-12V: 电机驱动.8 电池电源1.1 电源开关.1
AIN1: Stlink.12 U3.3
AIN2: Stlink.11 U3.2
AO1: 左电机.1 电机驱动.5
AO2: 左电机.6 电机驱动.4
BIN1: STM32F103C8T6核心板.20 U3.5
BIN2: STM32F103C8T6核心板.19 U3.6
BO1: 右电机.1 电机驱动.2
BO2: 右电机.6 电机驱动.3
D0: WT1-IMU串口.6
D2: U1.6
D3: U1.1
IN+: C4.1 IN+.1 电源开关.2
PA0: Stlink.16 右电机.3
PA1: Stlink.15 右电机.4
PA2: Stlink.14 WT1-IMU串口.4
PA3: Stlink.13 WT1-IMU串口.3
PA6: Stlink.10 U3.1
PA7: Stlink.9 U3.7
PA8: STM32F103C8T6核心板.16
PA9: STM32F103C8T6核心板.15 蓝牙模块.2
PA10: STM32F103C8T6核心板.14 蓝牙模块.3
PA11: STM32F103C8T6核心板.13
PA12: STM32F103C8T6核心板.12
PA15: STM32F103C8T6核心板.11
PB0: Stlink.8
PB1: Stlink.7
PB3: STM32F103C8T6核心板.10
PB4: STM32F103C8T6核心板.9
PB5: STM32F103C8T6核心板.8
PB6: STM32F103C8T6核心板.7 左电机.3
PB7: STM32F103C8T6核心板.6 左电机.4
PB8: OLED.3(SCL) STM32F103C8T6核心板.5
PB9: OLED.4(SDA) STM32F103C8T6核心板.4
PB10: Stlink.6
PB11: Stlink.5
PB14: STM32F103C8T6核心板.18
PB15: STM32F103C8T6核心板.17
PC13: Stlink.19
PC14: Stlink.18
PC15: Stlink.17
R: Stlink.4
SWIM: WT1-IMU串口.1
VB: Stlink.20
WT1-IMUI_SCL: U1.4
WT1-IMUI_SDA: U1.3

Not connected (* = marked no-connect by the designer): U1 2 5; 电源开关 3; 蓝牙模块 1 6

## Notes on the sheets
sheet 3
- 这里的IIC是虚拟iic没有用只是引了出来

# Board PCB1
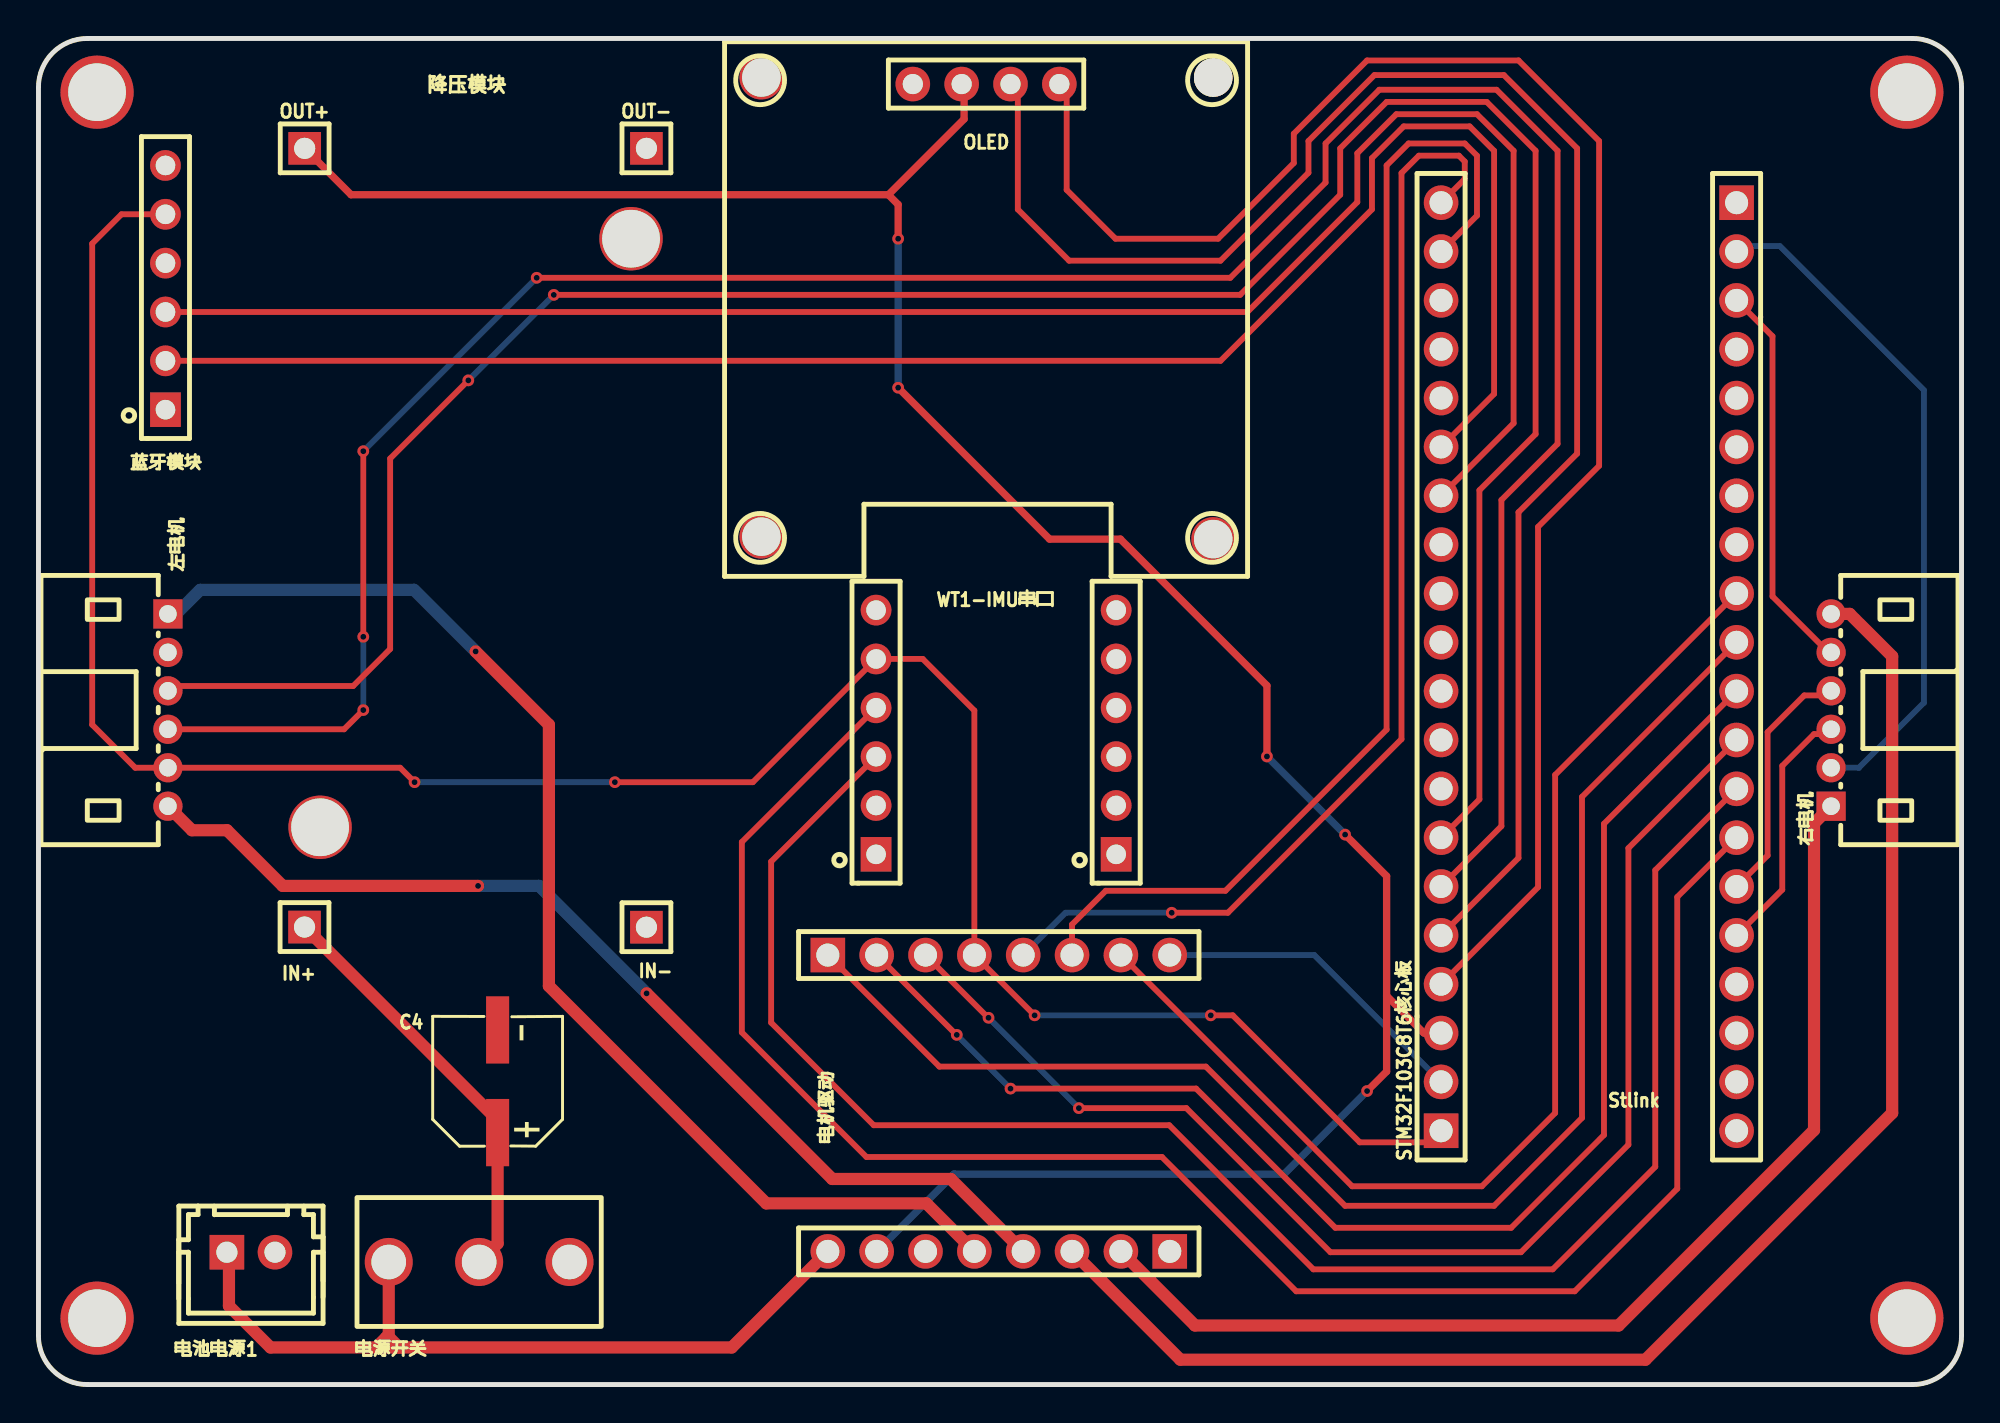
[diagram p6: board, top side]
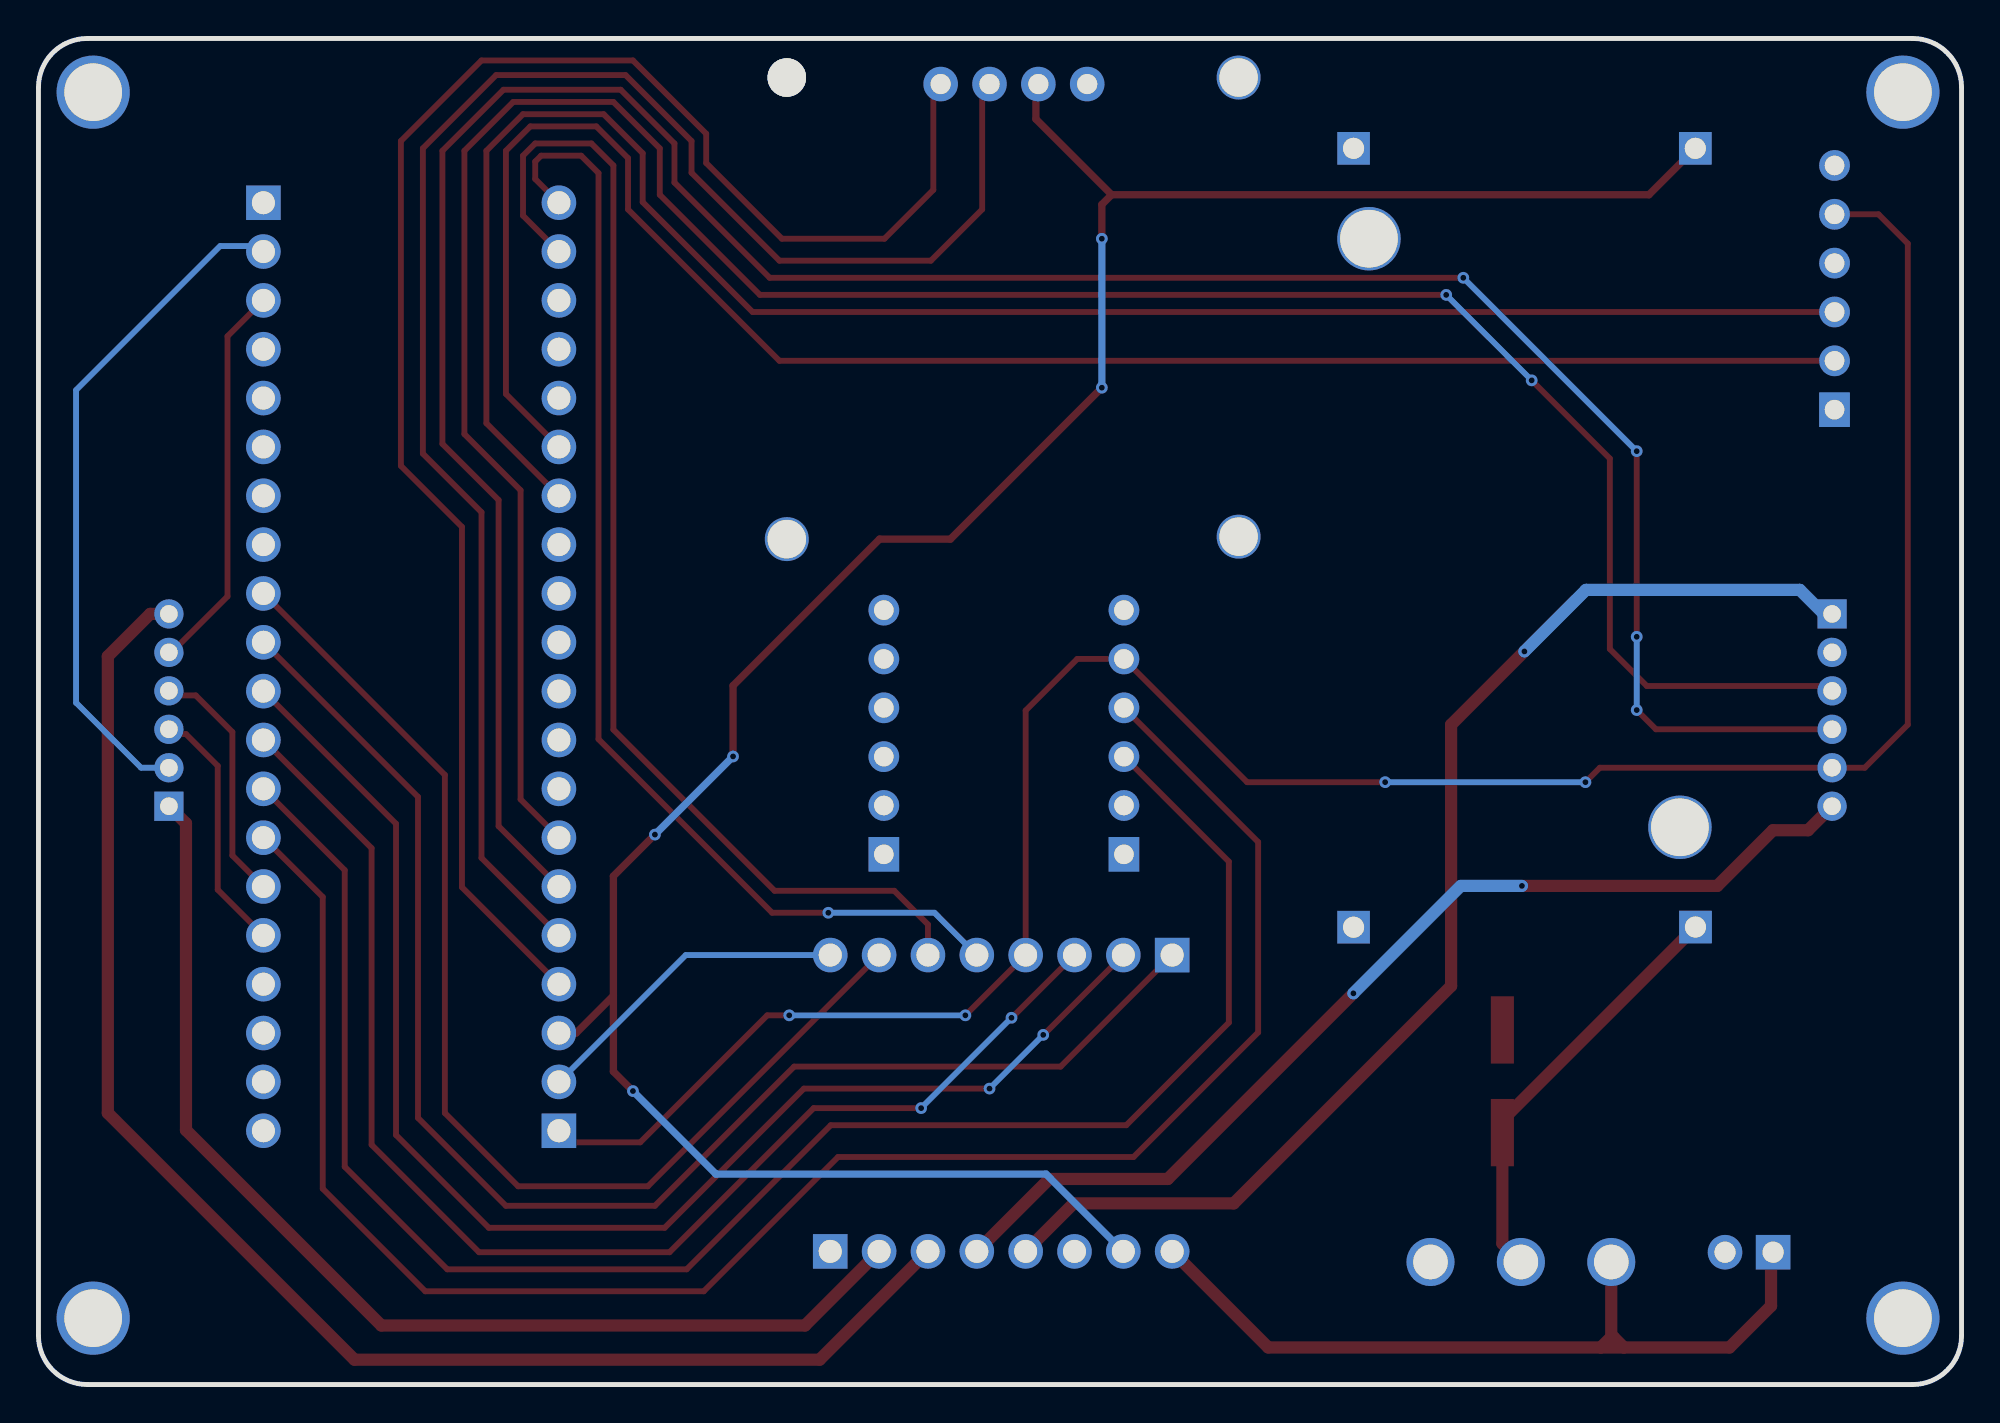
[diagram p7: board, bottom side, seen from below]

Outline 100 x 70 mm; copper layers: Top Layer, Bottom Layer. Coordinates in mm from the lower left corner of the outline.
Outline path: 0,67.46 0,2.54 arc(0.74,0.74) 2.54,0 97.46,0 arc(99.26,0.74) 100,2.54 100,67.46 arc(99.26,69.26) 97.46,70 2.54,70 arc(0.74,69.26) 0,67.46
Stack: Top Layer 0.035mm / Dielectric1 1.51mm FR4 er 4.5 / Bottom Layer 0.035mm

## Design rules (mm)
template: JLCPCB Capability(Two Layers Board)
spacing copperThickness1oz (default): track to track 0.102, other pairs 0.152 to 0.3
spacing copperThickness2oz: track to track 0.203, other pairs 0.152 to 0.3
track width copperThickness1oz (default): min 0.127, default 0.254, max 2.54
track width copperThickness2oz: min 0.203, default 0.254, max 2.54
differential pair differentialPair (default): width min 0.127, default 0.254, max 2.54; gap min 0.152, default 0.152
via viaSize (default): diameter min 0.5, default 0.61, max 10; hole min 0.3, default 0.305, max 6.3

## Placement (name value [footprint] x y rotation side)
C4  470uF  [CAP-SMD_BD6.3-L6.6-W6.6-LS7.6-RD]  23.88 15.77 90 top
IN+  2.54-1*1P针  [hdr-th_1p-p2.54-v-m]  13.83 23.79 0 top
IN-  2.54-1*1P针  [hdr-th_1p-p2.54-v-m]  31.61 23.78 0 top
NOREF  -  [Pad_e40]  37.59 67.97 0 top
NOREF#2  -  [Pad_e45]  61.09 67.97 0 top
NOREF#3  -  [Pad_e48]  37.59 44.09 0 top
NOREF#4  -  [Pad_e103]  30.81 59.59 0 top
NOREF#5  -  [Pad_e1712]  97.15 3.45 0 top
NOREF#6  -  [Pad_e47]  61.09 43.96 0 top
NOREF#7  -  [Pad_e1738]  3.05 3.45 0 top
NOREF#8  -  [Pad_e1710]  97.15 67.21 0 top
NOREF#9  -  [Pad_e71]  14.64 28.98 0 top
NOREF#10  -  [Pad_e1713]  3.05 67.21 0 top
OLED  OLED  [OLED-TH_L27.8-W27.2-P2.54_C9900033791]  49.28 67.63 0 top
OUT+  2.54-1*1P针  [hdr-th_1p-p2.54-v-m]  13.84 64.28 0 top
OUT-  2.54-1*1P针  [hdr-th_1p-p2.54-v-m]  31.61 64.28 0 top
Stlink  Stlink  [HDR-TH_20P-P2.54-V-F]  88.3 37.33 270 top
STM32F103C8T6核心板  STM32F103C8T6核心板  [HDR-TH_20P-P2.54-V-F]  72.94 37.33 90 top
U1  2.54-1*6P母  [HDR-TH_6P-P2.54-V-F]  56.04 33.92 90 top
U3  2.54-1*8P母环保  [HDR-TH_8P-P2.54-V-F-1]  49.94 22.33 0 top
WT1-IMU串口  WT1-IMU串口  [HDR-TH_6P-P2.54-V-F]  43.56 33.92 90 top
右电机  HDGC2001WR-6P  [CONN-TH_6P-P2.00_HDGC_HDGC2001WR-6P]  93.22 35.07 90 top
左电机  HDGC2001WR-6P  [CONN-TH_6P-P2.00_HDGC_HDGC2001WR-6P]  6.73 35.07 270 top
电机驱动  2.54-1*8P母环保  [HDR-TH_8P-P2.54-V-F-1]  49.94 6.92 180 top
电池电源1  ZX-XH2.54-2PZZ  [CONN-TH_2P-P2.50_HX25003-2A]  11.05 6.88 0 top
电源开关  SS-12D10L5  [SW-TH_SS-12D10L5]  22.91 6.37 0 top
蓝牙模块  2.54-1*6P母  [HDR-TH_6P-P2.54-V-F]  6.6 57.05 90 top

## Footprints (pads in the part's own frame, mm; a bottom-side part is the same pattern mirrored in y, then rotated)
CAP-SMD_BD6.3-L6.6-W6.6-LS7.6-RD
  rect 3.5x1.2 smd: 1(-2.67,0) 2(2.67,0)
CONN-TH_2P-P2.50_HX25003-2A
  rect 1.8x1.8 hole 1.1: 1(-1.25,0)
  round 1.8 hole 1.1: 2(1.25,0)
CONN-TH_6P-P2.00_HDGC_HDGC2001WR-6P
  rect 1.524x1.524 hole 0.914: 1(-5,0)
  round 1.524 hole 0.914: 2(-3,0) 3(-1,0) 4(1,0) 5(3,0) 6(5,0)
hdr-th_1p-p2.54-v-m
  rect 1.7x1.7 hole 1.1: 1(0,0)
HDR-TH_6P-P2.54-V-F
  rect 1.8x1.6 hole 1.02: 1(-6.35,0)
  round 1.6 hole 1.02: 2(-3.81,0) 3(-1.27,0) 4(1.27,0) 5(3.81,0) 6(6.35,0)
HDR-TH_8P-P2.54-V-F-1
  rect 1.8x1.8 hole 1.2: 1(-8.89,0)
  round 1.8 hole 1.2: 2(-6.35,0) 3(-3.81,0) 4(-1.27,0) 5(1.27,0) 6(3.81,0) 7(6.35,0) 8(8.89,0)
HDR-TH_20P-P2.54-V-F
  rect 1.8x1.8 hole 1.2: 1(-24.13,0)
  round 1.8 hole 1.2: 2(-21.59,0) 3(-19.05,0) 4(-16.51,0) 5(-13.97,0) 6(-11.43,0) 7(-8.89,0) 8(-6.35,0) 9(-3.81,0) 10(-1.27,0) 11(1.27,0) 12(3.81,0) 13(6.35,0) 14(8.89,0) 15(11.43,0) 16(13.97,0) 17(16.51,0) 18(19.05,0) 19(21.59,0) 20(24.13,0)
OLED-TH_L27.8-W27.2-P2.54_C9900033791
  round 1.8 hole 1.05: 1(-3.81,0) 2(-1.27,0) 3(1.27,0) 4(3.81,0)
Pad_e40
  round 2.286 hole 2: 5(0,0)
Pad_e45
  round 2 hole 2.286: 5(0,0)
Pad_e47
  round 2.286 hole 2: 5(0,0)
Pad_e48
  round 2.286 hole 2: 5(0,0)
Pad_e71
  round 3.302 hole 3: 5(0,0)
Pad_e103
  round 3.302 hole 3: 5(0,0)
Pad_e1710
  round 3.81 hole 3: 7(0,0)
Pad_e1712
  round 3.81 hole 3: 7(0,0)
Pad_e1713
  round 3.81 hole 3: 7(0,0)
Pad_e1738
  round 3.81 hole 3: 7(0,0)
SW-TH_SS-12D10L5
  round 2.5 hole 1.8: 1(-4.7,0) 2(0,0) 3(4.7,0)

## Nets
As in the schematic.

Pads without a net: NOREF 5; NOREF#2 5; NOREF#3 5; NOREF#4 5; NOREF#5 7; NOREF#6 5; NOREF#7 7; NOREF#8 7; NOREF#9 5; NOREF#10 7; 电源开关 3; 蓝牙模块 1 6

## Via types
v1: diameter 0.61, hole 0.305, Top Layer to Bottom Layer, 23 vias

## Routing (per net, layer and track width the routed paths; a pad name or vN(x,y) marks a point on that pad's centre or on a via; arc(x,y) is an arc through that point)
3.3V: length 121.6
  Top Layer w0.305: v1(19.56,31.32) 18.81,32.07 左电机.5 5.03,32.07 2.79,34.31 2.79,59.33 4.32,60.86 蓝牙模块.5 ; STM32F103C8T6核心板.1 72.33,12.6 68.71,12.6 62.1,19.2 v1(60.96,19.2) ; v1(51.8,19.2) U3.4 48.67,35.05 45.98,37.73 WT1-IMU串口.5 37.15,31.32 v1(29.97,31.32)
  Bottom Layer w0.305: v1(51.8,19.2) v1(60.96,19.2) ; v1(19.56,31.32) v1(29.97,31.32)
3.33V: length 20.4
  Top Layer w0.305: 右电机.5 93.08,38.07 90.17,40.98 90.17,54.51 Stlink.3
5V: length 131.4
  Top Layer w0.381: 70.1,20.22 70.1,16.28 v1(69.09,15.26) ; 70.1,20.22 70.1,26.44 v1(67.95,28.6) ; 70.1,20.22 72.04,18.28 STM32F103C8T6核心板.3 ; 48.39,67.71 48.13,67.46 48.13,65.81 44.2,61.87 ; 44.2,61.87 44.7,61.36 v1(44.7,59.59) ; 44.2,61.87 16.26,61.87 OUT+.1 ; v1(63.88,32.66) 63.88,36.34 56.26,43.96 52.58,43.96 v1(44.7,51.84)
  Bottom Layer w0.381: v1(69.09,15.26) 64.77,10.94 47.61,10.94 电机驱动.7 ; v1(44.7,51.84) v1(44.7,59.59) ; v1(63.88,32.66) v1(67.95,28.6)
GND: length 52.3
  Bottom Layer w0.305: 右电机.2 94.66,32.07 98.04,35.46 98.04,51.71 90.55,59.2 88.59,59.2 Stlink.2 ; STM32F103C8T6核心板.2 66.34,22.33 U3.8
6-12V: length 42.5
  Top Layer w0.635: 18.21,2.45 18.08,2.45 17.56,1.93 ; 18.21,2.45 18.24,2.45 18.76,1.93 ; 18.21,2.45 电源开关.1 ; 18.76,1.93 36.05,1.93 电机驱动.8 ; 18.76,1.93 17.56,1.93 ; 17.56,1.93 12.06,1.93 9.91,4.09 9.91,6.77 电池电源1.1
AIN1: length 68.6
  Top Layer w0.305: v1(49.4,19.07) 49.39,19.07 U3.3 ; v1(54.1,14.37) 59.69,14.37 67.18,6.88 77.09,6.88 82.68,12.47 82.68,27.89 Stlink.12
  Bottom Layer w0.305: v1(49.4,19.07) v1(54.1,14.37)
AIN2: length 71.6
  Top Layer w0.305: v1(50.55,15.39) 60.2,15.39 67.44,8.15 76.58,8.15 81.41,12.98 81.41,29.16 Stlink.11 ; v1(47.75,18.18) 47.74,18.18 U3.2
  Bottom Layer w0.305: v1(47.75,18.18) v1(50.55,15.39)
AO1: length 64.7
  Top Layer w0.635: v1(22.73,38.12) 26.54,34.31 26.54,20.72 37.85,9.42 46.17,9.42 电机驱动.5
  Bottom Layer w0.635: v1(22.73,38.12) 19.53,41.32 8.41,41.32 7.16,40.07 左电机.1
AO2: length 54.1
  Top Layer w0.635: v1(22.86,25.93) 12.7,25.93 9.81,28.82 7.98,28.82 左电机.6 ; 电机驱动.4 47.44,10.69 41.27,10.69 v1(31.62,20.34)
  Bottom Layer w0.635: v1(22.86,25.93) 26.03,25.93 v1(31.62,20.34)
BIN1: length 60.2
  Top Layer w0.305: v1(58.93,24.53) 61.85,24.53 70.88,33.56 70.88,63 71.78,63.9 73.86,63.9 74.17,63.6 74.17,62.69 STM32F103C8T6核心板.20
  Bottom Layer w0.305: v1(58.93,24.53) 53.41,24.53 U3.5
BIN2: length 62.7
  Top Layer w0.305: STM32F103C8T6核心板.19 74.8,60.79 74.8,63.9 74.17,64.54 71.25,64.54 70.1,63.4 70.1,34.06 61.72,25.68 55.5,25.68 53.75,23.92 U3.6
BO1: length 59.1
  Top Layer w0.635: 电机驱动.2 60.14,3.07 82.17,3.07 92.33,13.23 92.33,29.19 右电机.1
BO2: length 78.1
  Top Layer w0.635: 右电机.6 94.19,40.07 96.39,37.87 96.39,14.12 83.57,1.29 59.38,1.29 电机驱动.3
IN+: length 22
  Top Layer w0.635: IN+.1 23.88,13.75 C4.1 23.88,7.33 电源开关.2
PA0: length 13.1
  Top Layer w0.305: Stlink.16 90.68,25.73 90.68,32.17 92.33,33.82 92.97,33.82 右电机.3
PA1: length 12.9
  Top Layer w0.305: Stlink.15 89.92,27.51 89.92,33.93 91.82,35.84 92.98,35.84 右电机.4
PA2: length 95.7
  Top Layer w0.305: WT1-IMU串口.4 36.58,28.21 36.58,18.31 43.05,11.83 58.42,11.83 65.4,4.85 79.88,4.85 85.22,10.18 85.22,25.35 Stlink.14
PA3: length 91
  Top Layer w0.305: WT1-IMU串口.3 38.1,27.2 38.1,18.82 43.43,13.48 58.8,13.48 66.29,5.99 78.74,5.99 84.07,11.33 84.07,26.75 Stlink.13
PA6: length 74.6
  Top Layer w0.305: U3.1 46.85,16.53 60.71,16.53 67.95,9.29 75.69,9.29 80.26,13.87 80.26,30.56 Stlink.10
PA7: length 60.1
  Top Layer w0.305: U3.7 68.31,10.31 75.06,10.31 78.87,14.12 78.87,31.7 Stlink.9
PA9: length 92.8
  Top Layer w0.305: 蓝牙模块.2 61.47,53.24 69.34,61.11 69.34,63.78 70.99,65.43 74.42,65.43 75.69,64.16 75.69,51.51 STM32F103C8T6核心板.15
PA10: length 96.1
  Top Layer w0.305: STM32F103C8T6核心板.14 76.71,49.99 76.71,64.16 74.8,66.06 70.61,66.06 68.58,64.03 68.58,61.49 62.86,55.78 6.6,55.78
PB6: length 129.8
  Top Layer w0.305: STM32F103C8T6核心板.7 74.93,30.43 74.93,46.5 77.85,49.43 77.85,64.16 75.31,66.7 70.1,66.7 67.69,64.28 67.69,61.87 62.48,56.66 v1(26.8,56.66) ; v1(22.35,52.22) 18.29,48.16 18.29,38.25 16.36,36.32 7.11,36.32
  Top Layer w0.635: 7.11,36.32 6.86,36.07 左电机.3
  Bottom Layer w0.305: v1(22.35,52.22) v1(26.8,56.66)
PB7: length 137.2
  Top Layer w0.305: 左电机.4 15.89,34.07 v1(16.89,35.07) ; STM32F103C8T6核心板.6 76.07,29.04 76.07,46 78.99,48.92 78.99,64.16 75.82,67.33 69.72,67.33 66.93,64.54 66.93,62.51 61.98,57.55 v1(25.91,57.55) ; v1(16.89,48.54) v1(16.89,38.88)
  Bottom Layer w0.305: v1(25.91,57.55) v1(16.89,48.54) ; v1(16.89,38.88) v1(16.89,35.07)
PB8: length 87.2
  Top Layer w0.305: 50.93,67.71 50.93,61.11 53.59,58.44 61.47,58.44 66.04,63.01 66.04,64.67 69.47,68.09 76.2,68.09 80.01,64.28 80.01,48.41 76.96,45.36 76.96,27.38 STM32F103C8T6核心板.5
PB9: length 88
  Top Layer w0.305: 53.47,67.71 53.47,62.13 56.01,59.59 61.34,59.59 65.28,63.52 65.28,65.05 69.09,68.86 76.96,68.86 81.15,64.67 81.15,47.77 77.98,44.6 77.98,25.86 STM32F103C8T6核心板.4

## Text on the board
Top Silkscreen Layer: 降压模块
